# Altium schematic sheet STALO_2.SchDoc: STALO_2 (part 1 of 2)
size D; Date: 09-24-10; DrawnBy: C. Lewis; Engineer: C. Lewis; Address1: 4650 NORRIS CANYON RD.; Address2: SAN RAMON, CA 94583; DocumentNumber: 35133; Revision: D; SheetNumber: 19; SheetTotal: 20; PageSetup: Record=PageOptions|CenterHorizontal=True|CenterVertical=True|PrintScale=0.34|XCorrection=1.00|YCorrection=1.00|PrintKind=1|BorderSize=5000000|LeftOffset=0|BottomOffset=0|Orientation=2|PaperLength=1000|PaperWidth=1000|Scale=100|PaperSource=15|PrintQuality=600|MediaType=1|DitherType=10|PaperKind=11x17|PrintScaleMode=1; DocumentName: Sheet1.SCHDOC; ModifiedDate: 10-27-11
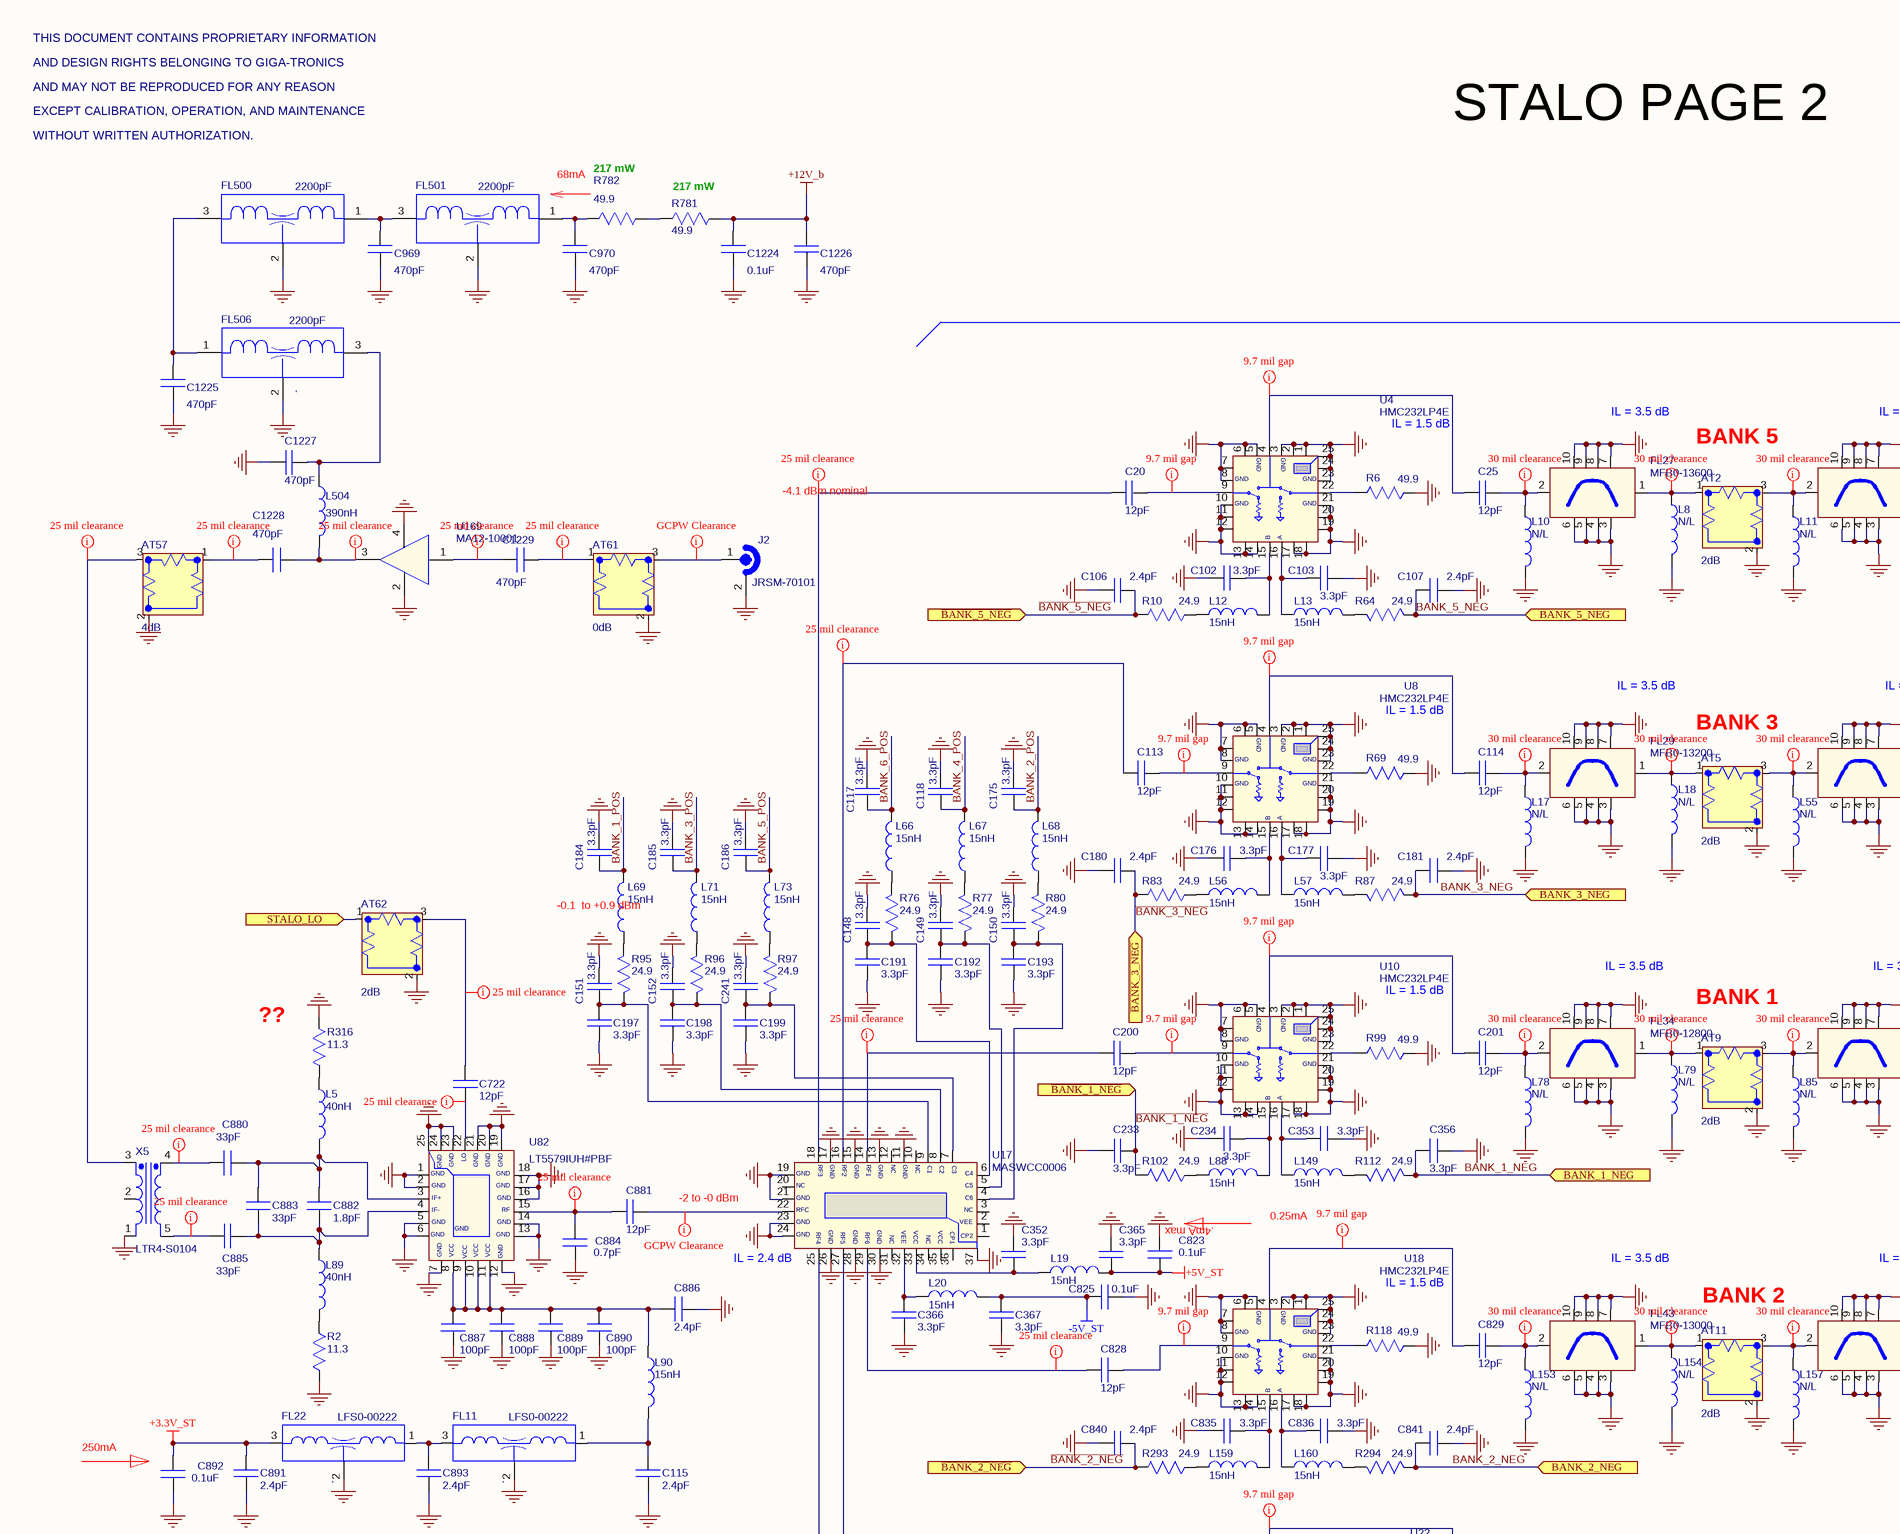
[diagram p0: STALO_2.SchDoc, top left]
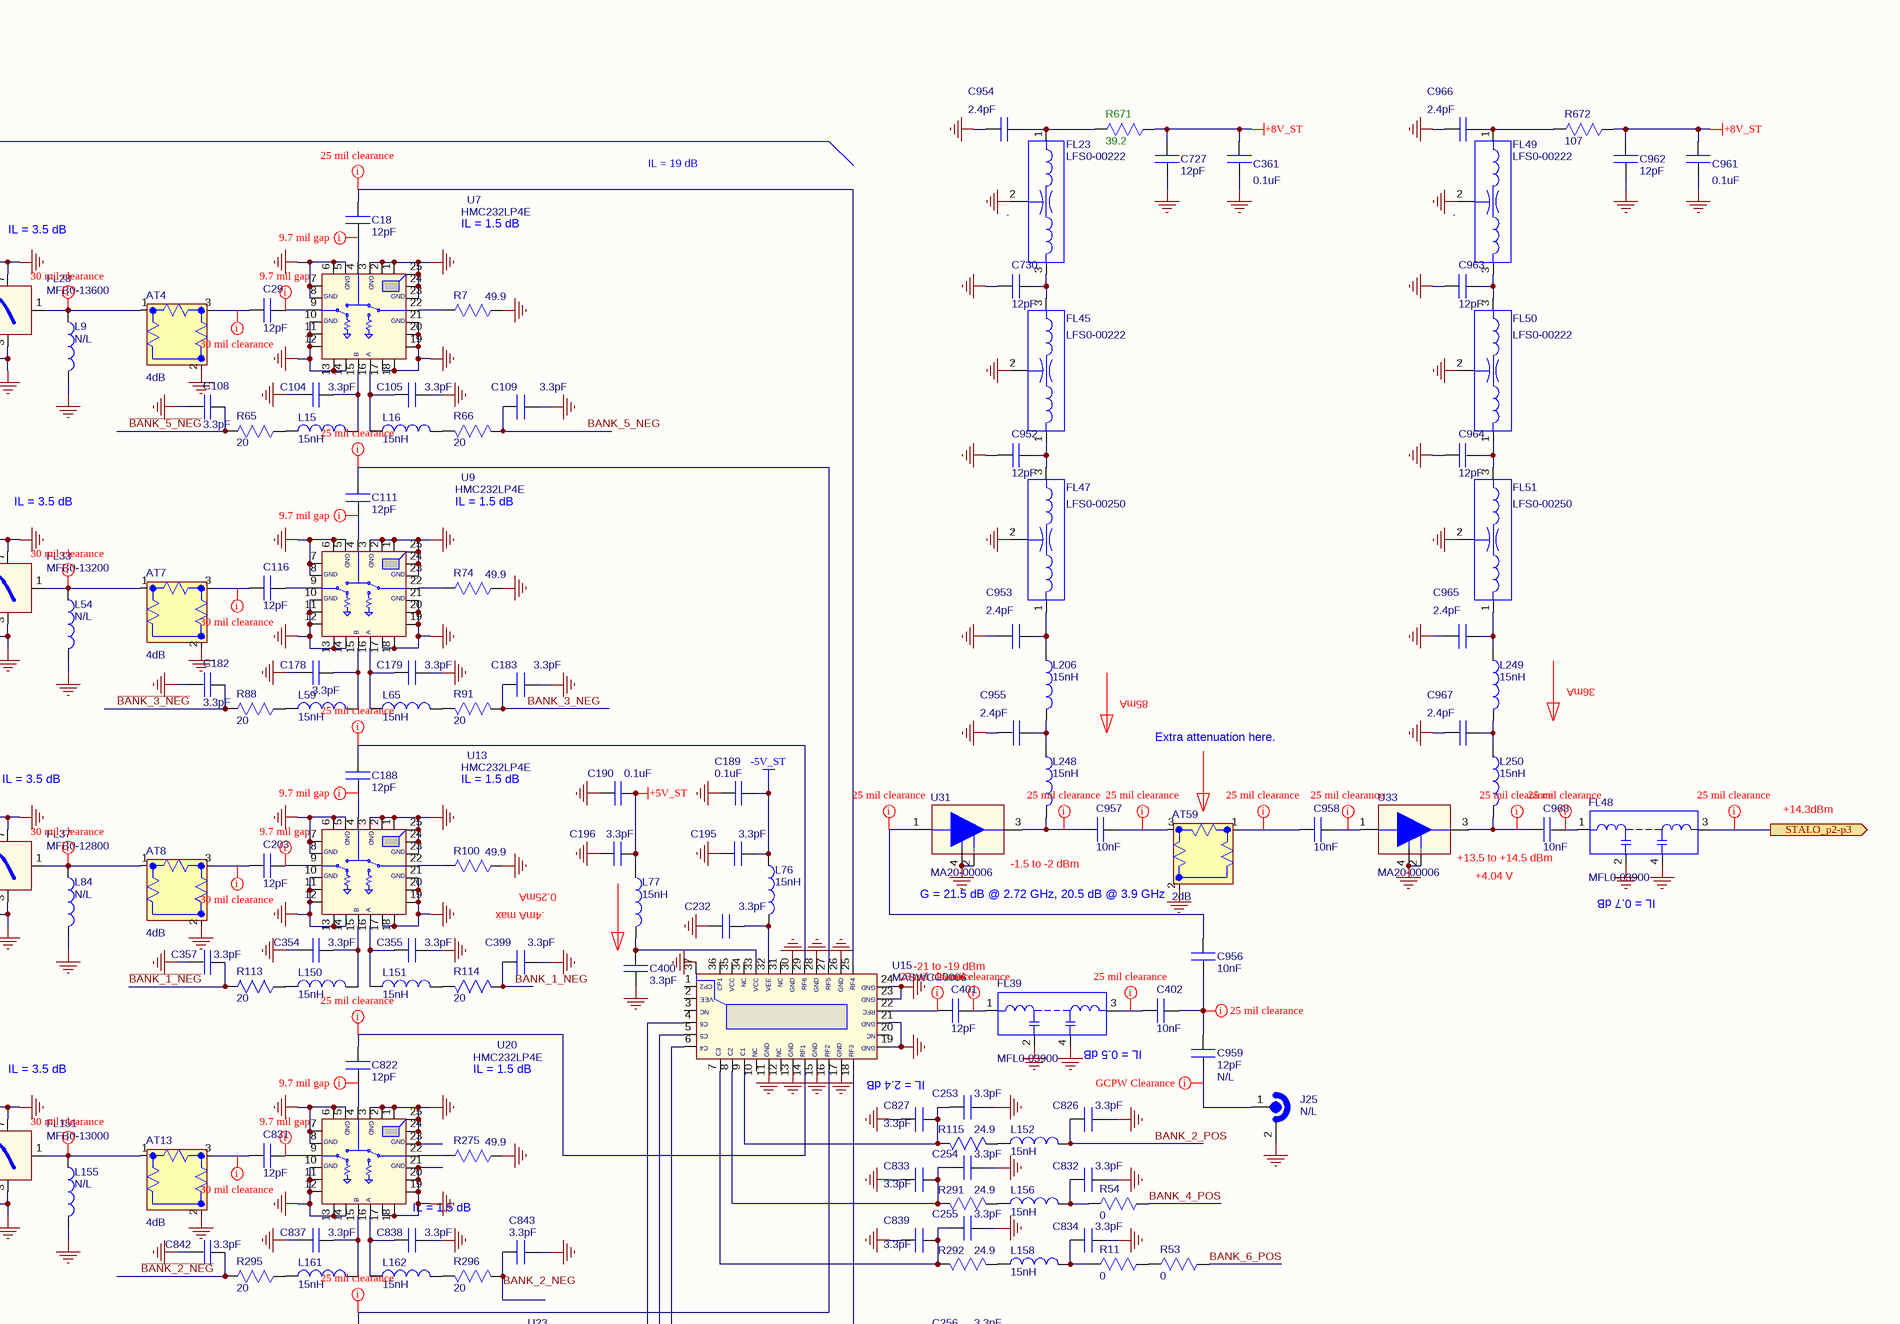
[diagram p1: STALO_2.SchDoc, top right]
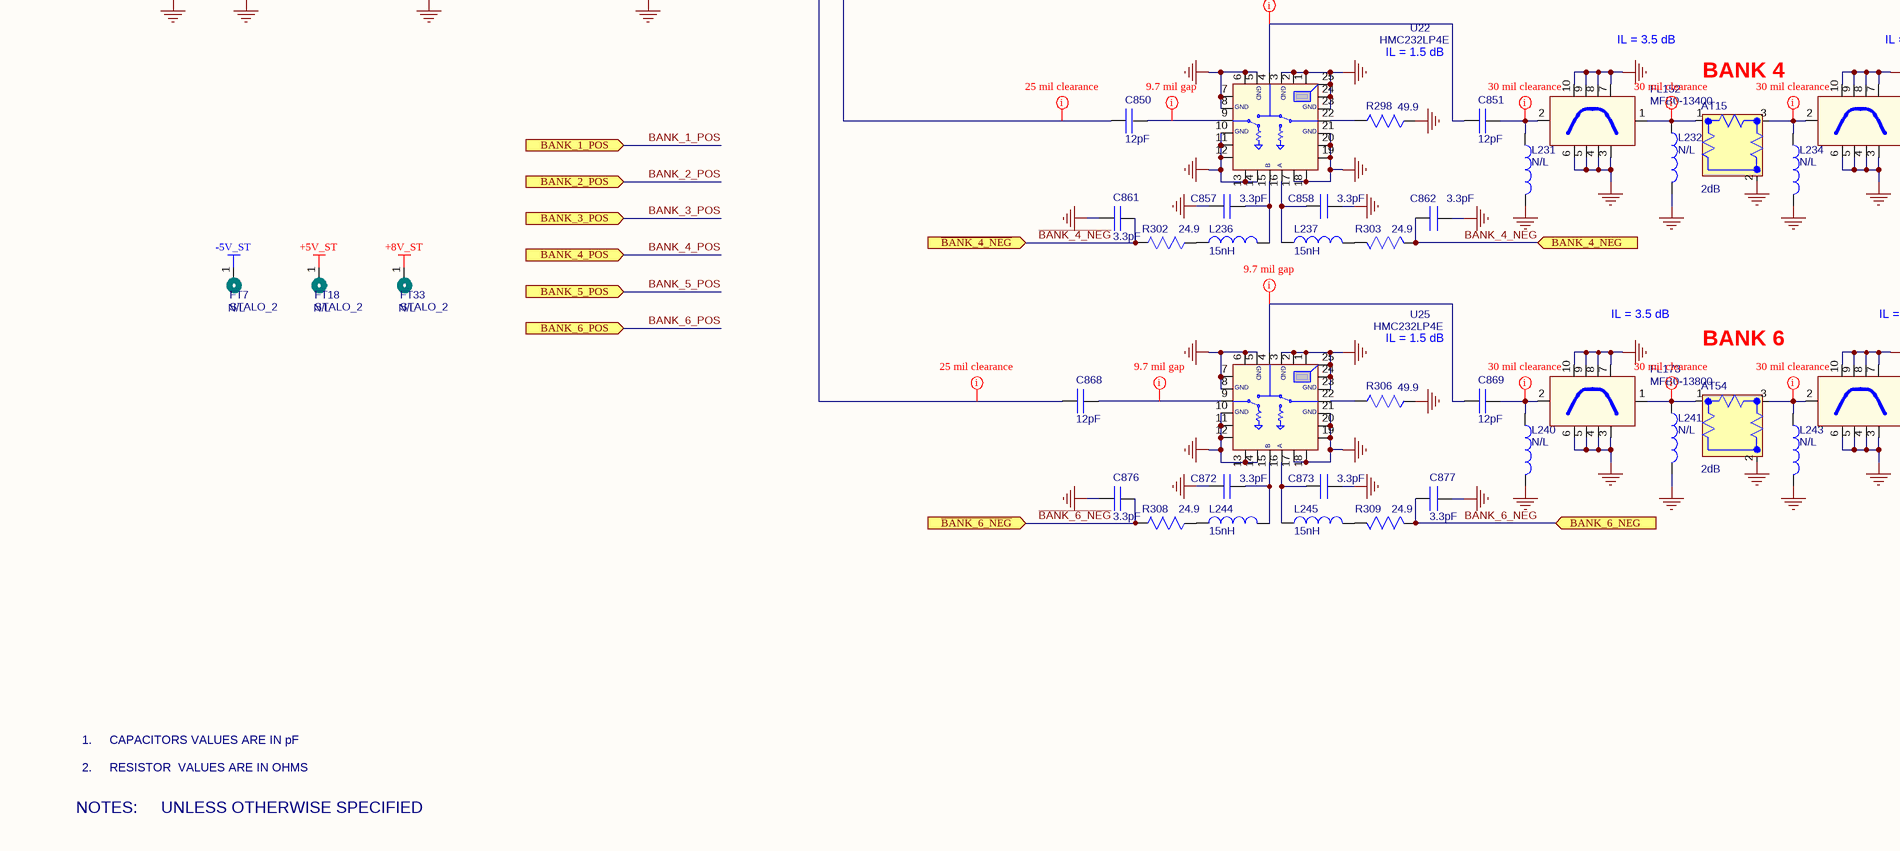
[diagram p2: STALO_2.SchDoc, bottom left]
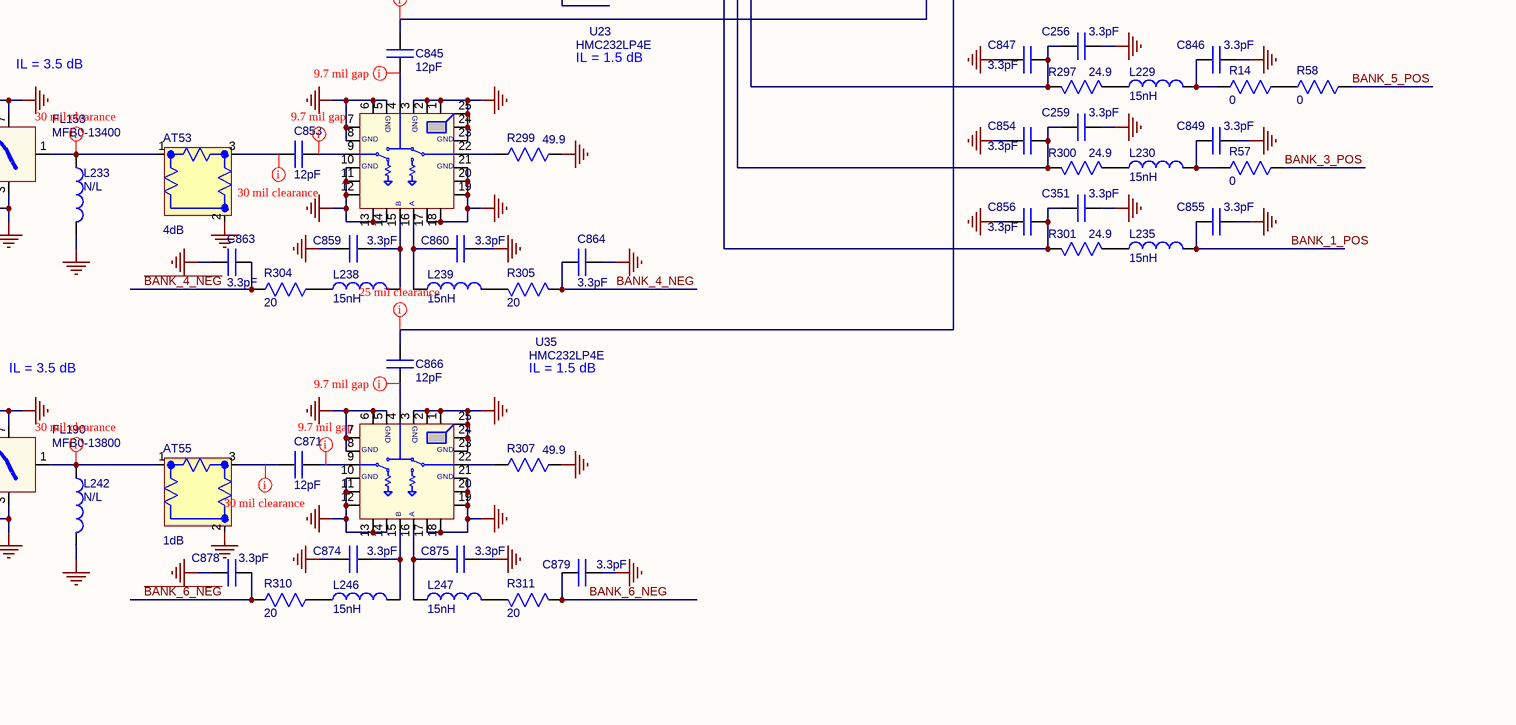
[diagram p3: STALO_2.SchDoc, bottom right]

## Parts
AT2  value 2dB  [ATTN-IMS-0805]  (hidden comment: PAD;CHIP;2dB;+/-.3dB;.08 x .05;50 OHM;FACE DOWN)
AT4  value 4dB  [ATTN-IMS-0805]  (hidden comment: PAD;CHIP;4dB;+/-.3dB;.08 x .05;50 OHM;FACE DOWN)
AT5  value 2dB  [ATTN-IMS-0805]  (hidden comment: PAD;CHIP;2dB;+/-.3dB;.08 x .05;50 OHM;FACE DOWN)
AT7  value 4dB  [ATTN-IMS-0805]  (hidden comment: PAD;CHIP;4dB;+/-.3dB;.08 x .05;50 OHM;FACE DOWN)
AT8  value 4dB  [ATTN-IMS-0805]  (hidden comment: PAD;CHIP;4dB;+/-.3dB;.08 x .05;50 OHM;FACE DOWN)
AT9  value 2dB  [ATTN-IMS-0805]  (hidden comment: PAD;CHIP;2dB;+/-.3dB;.08 x .05;50 OHM;FACE DOWN)
AT11  value 2dB  [ATTN-IMS-0805]  (hidden comment: PAD;CHIP;2dB;+/-.3dB;.08 x .05;50 OHM;FACE DOWN)
AT13  value 4dB  [ATTN-IMS-0805]  (hidden comment: PAD;CHIP;4dB;+/-.3dB;.08 x .05;50 OHM;FACE DOWN)
AT15  value 2dB  [ATTN-IMS-0805]  (hidden comment: PAD;CHIP;2dB;+/-.3dB;.08 x .05;50 OHM;FACE DOWN)
AT53  value 4dB  [ATTN-IMS-0805]  (hidden comment: PAD;CHIP;4dB;+/-.3dB;.08 x .05;50 OHM;FACE DOWN)
AT54  value 2dB  [ATTN-IMS-0805]  (hidden comment: PAD;CHIP;2dB;+/-.3dB;.08 x .05;50 OHM;FACE DOWN)
AT55  value 1dB  [ATTN-IMS-0805]  (hidden comment: PAD;CHIP;1dB;+/-.3dB;.08 x .05;50 OHM;FACE DOWN)
AT57  value 4dB  [ATTN-IMS-0805]  (hidden comment: PAD;CHIP;4dB;+/-.3dB;.08 x .05;50 OHM;FACE DOWN)
AT59  value 2dB  [ATTN-IMS-0805]  (hidden comment: PAD;CHIP;2dB;+/-.3dB;.08 x .05;50 OHM;FACE DOWN)
AT61  value 0dB  [ATTN-IMS-0805]  (hidden comment: PAD;CHIP;0dB;+/-.3dB;.08 x .05;50 OHM;FACE DOWN)
AT62  value 2dB  [ATTN-IMS-0805]  (hidden comment: PAD;CHIP;2dB;+/-.3dB;.08 x .05;50 OHM;FACE DOWN)
C18  value 12pF  [CAP-0402-N]  (hidden comment: 12 PF;5%;COG;>50V;CHIP;0402)
C20  value 12pF  [CAP-0402-N]  (hidden comment: 12 PF;5%;COG;>50V;CHIP;0402)
C25  value 12pF  [CAP-0402-N]  (hidden comment: 12 PF;5%;COG;>50V;CHIP;0402)
C29  value 12pF  [CAP-0402-N]  (hidden comment: 12 PF;5%;COG;>50V;CHIP;0402)
C102  value 3.3pF  [CAP-0201-N]  (hidden comment: 3.3pF;5%;COG;50V;CHIP;0201)
C103  value 3.3pF  [CAP-0201-N]  (hidden comment: 3.3pF;5%;COG;50V;CHIP;0201)
C104  value 3.3pF  [CAP-0201-N]  (hidden comment: 3.3pF;5%;COG;50V;CHIP;0201)
C105  value 3.3pF  [CAP-0201-N]  (hidden comment: 3.3pF;5%;COG;50V;CHIP;0201)
C106  value 2.4pF  [CAP-0402-RF]  (hidden comment: 2.4 PF;200V;.05PF;HIGH Q;SMT;CERAMIC;0402)
C107  value 2.4pF  [CAP-0402-RF]  (hidden comment: 2.4 PF;200V;.05PF;HIGH Q;SMT;CERAMIC;0402)
C108  value 3.3pF  [CAP-0201-N]  (hidden comment: 3.3pF;5%;COG;50V;CHIP;0201)
C109  value 3.3pF  [CAP-0201-N]  (hidden comment: 3.3pF;5%;COG;50V;CHIP;0201)
C111  value 12pF  [CAP-0402-N]  (hidden comment: 12 PF;5%;COG;>50V;CHIP;0402)
C113  value 12pF  [CAP-0402-N]  (hidden comment: 12 PF;5%;COG;>50V;CHIP;0402)
C114  value 12pF  [CAP-0402-N]  (hidden comment: 12 PF;5%;COG;>50V;CHIP;0402)
C115  value 2.4pF  [CAP-0402-RF]  (hidden comment: 2.4 PF;200V;.05PF;HIGH Q;SMT;CERAMIC;0402)
C116  value 12pF  [CAP-0402-N]  (hidden comment: 12 PF;5%;COG;>50V;CHIP;0402)
C117  value 3.3pF  [CAP-0201-N]  (hidden comment: 3.3pF;5%;COG;50V;CHIP;0201)
C118  value 3.3pF  [CAP-0201-N]  (hidden comment: 3.3pF;5%;COG;50V;CHIP;0201)
C148  value 3.3pF  [CAP-0201-N]  (hidden comment: 3.3pF;5%;COG;50V;CHIP;0201)
C149  value 3.3pF  [CAP-0201-N]  (hidden comment: 3.3pF;5%;COG;50V;CHIP;0201)
C150  value 3.3pF  [CAP-0201-N]  (hidden comment: 3.3pF;5%;COG;50V;CHIP;0201)
C151  value 3.3pF  [CAP-0201-N]  (hidden comment: 3.3pF;5%;COG;50V;CHIP;0201)
C152  value 3.3pF  [CAP-0201-N]  (hidden comment: 3.3pF;5%;COG;50V;CHIP;0201)
C175  value 3.3pF  [CAP-0201-N]  (hidden comment: 3.3pF;5%;COG;50V;CHIP;0201)
C176  value 3.3pF  [CAP-0201-N]  (hidden comment: 3.3pF;5%;COG;50V;CHIP;0201)
C177  value 3.3pF  [CAP-0201-N]  (hidden comment: 3.3pF;5%;COG;50V;CHIP;0201)
C178  value 3.3pF  [CAP-0201-N]  (hidden comment: 3.3pF;5%;COG;50V;CHIP;0201)
C179  value 3.3pF  [CAP-0201-N]  (hidden comment: 3.3pF;5%;COG;50V;CHIP;0201)
C180  value 2.4pF  [CAP-0402-RF]  (hidden comment: 2.4 PF;200V;.05PF;HIGH Q;SMT;CERAMIC;0402)
C181  value 2.4pF  [CAP-0402-RF]  (hidden comment: 2.4 PF;200V;.05PF;HIGH Q;SMT;CERAMIC;0402)
C182  value 3.3pF  [CAP-0201-N]  (hidden comment: 3.3pF;5%;COG;50V;CHIP;0201)
C183  value 3.3pF  [CAP-0201-N]  (hidden comment: 3.3pF;5%;COG;50V;CHIP;0201)
C184  value 3.3pF  [CAP-0201-N]  (hidden comment: 3.3pF;5%;COG;50V;CHIP;0201)
C185  value 3.3pF  [CAP-0201-N]  (hidden comment: 3.3pF;5%;COG;50V;CHIP;0201)
C186  value 3.3pF  [CAP-0201-N]  (hidden comment: 3.3pF;5%;COG;50V;CHIP;0201)
C188  value 12pF  [CAP-0402-N]  (hidden comment: 12 PF;5%;COG;>50V;CHIP;0402)
C189  value 0.1uF  [CAP-0402-N]  (hidden comment: .1 UF,10%;X7R;16V,CHIP;0402)
C190  value 0.1uF  [CAP-0402-N]  (hidden comment: .1 UF,10%;X7R;16V,CHIP;0402)
C191  value 3.3pF  [CAP-0201-N]  (hidden comment: 3.3pF;5%;COG;50V;CHIP;0201)
C192  value 3.3pF  [CAP-0201-N]  (hidden comment: 3.3pF;5%;COG;50V;CHIP;0201)
C193  value 3.3pF  [CAP-0201-N]  (hidden comment: 3.3pF;5%;COG;50V;CHIP;0201)
C195  value 3.3pF  [CAP-0201-N]  (hidden comment: 3.3pF;5%;COG;50V;CHIP;0201)
C196  value 3.3pF  [CAP-0201-N]  (hidden comment: 3.3pF;5%;COG;50V;CHIP;0201)
C197  value 3.3pF  [CAP-0201-N]  (hidden comment: 3.3pF;5%;COG;50V;CHIP;0201)
C198  value 3.3pF  [CAP-0201-N]  (hidden comment: 3.3pF;5%;COG;50V;CHIP;0201)
C199  value 3.3pF  [CAP-0201-N]  (hidden comment: 3.3pF;5%;COG;50V;CHIP;0201)
C200  value 12pF  [CAP-0402-N]  (hidden comment: 12 PF;5%;COG;>50V;CHIP;0402)
C201  value 12pF  [CAP-0402-N]  (hidden comment: 12 PF;5%;COG;>50V;CHIP;0402)
C203  value 12pF  [CAP-0402-N]  (hidden comment: 12 PF;5%;COG;>50V;CHIP;0402)
C232  value 3.3pF  [CAP-0201-N]  (hidden comment: 3.3pF;5%;COG;50V;CHIP;0201)
C233  value 3.3pF  [CAP-0201-N]  (hidden comment: 3.3pF;5%;COG;50V;CHIP;0201)
C234  value 3.3pF  [CAP-0201-N]  (hidden comment: 3.3pF;5%;COG;50V;CHIP;0201)
C241  value 3.3pF  [CAP-0201-N]  (hidden comment: 3.3pF;5%;COG;50V;CHIP;0201)
C253  value 3.3pF  [CAP-0201-N]  (hidden comment: 3.3pF;5%;COG;50V;CHIP;0201)
C254  value 3.3pF  [CAP-0201-N]  (hidden comment: 3.3pF;5%;COG;50V;CHIP;0201)
C255  value 3.3pF  [CAP-0201-N]  (hidden comment: 3.3pF;5%;COG;50V;CHIP;0201)
C256  value 3.3pF  [CAP-0201-N]  (hidden comment: 3.3pF;5%;COG;50V;CHIP;0201)
C259  value 3.3pF  [CAP-0201-N]  (hidden comment: 3.3pF;5%;COG;50V;CHIP;0201)
C351  value 3.3pF  [CAP-0201-N]  (hidden comment: 3.3pF;5%;COG;50V;CHIP;0201)
C352  value 3.3pF  [CAP-0201-N]  (hidden comment: 3.3pF;5%;COG;50V;CHIP;0201)
C353  value 3.3pF  [CAP-0201-N]  (hidden comment: 3.3pF;5%;COG;50V;CHIP;0201)
C354  value 3.3pF  [CAP-0201-N]  (hidden comment: 3.3pF;5%;COG;50V;CHIP;0201)
C355  value 3.3pF  [CAP-0201-N]  (hidden comment: 3.3pF;5%;COG;50V;CHIP;0201)
C356  value 3.3pF  [CAP-0201-N]  (hidden comment: 3.3pF;5%;COG;50V;CHIP;0201)
C357  value 3.3pF  [CAP-0201-N]  (hidden comment: 3.3pF;5%;COG;50V;CHIP;0201)
C361  value 0.1uF  [CAP-0603-H035-N]  (hidden comment: .1UF;10%;X7R;16V;CHIP;0603)
C365  value 3.3pF  [CAP-0201-N]  (hidden comment: 3.3pF;5%;COG;50V;CHIP;0201)
C366  value 3.3pF  [CAP-0201-N]  (hidden comment: 3.3pF;5%;COG;50V;CHIP;0201)
C367  value 3.3pF  [CAP-0201-N]  (hidden comment: 3.3pF;5%;COG;50V;CHIP;0201)
C399  value 3.3pF  [CAP-0201-N]  (hidden comment: 3.3pF;5%;COG;50V;CHIP;0201)
C400  value 3.3pF  [CAP-0201-N]  (hidden comment: 3.3pF;5%;COG;50V;CHIP;0201)
C401  value 12pF  [CAP-0402-N]  (hidden comment: 12 PF;5%;COG;>50V;CHIP;0402)
C402  value 10nF  [CAP-0402-N]  (hidden comment: 10nF;10%;X7R;16 WVDC;CHIP;0402)
C722  value 12pF  [CAP-0402-N]  (hidden comment: 12 PF;5%;COG;>50V;CHIP;0402)
C727  value 12pF  [CAP-0402-N]  (hidden comment: 12 PF;5%;COG;>50V;CHIP;0402)
C730  value 12pF  [CAP-0402-N]  (hidden comment: 12 PF;5%;COG;>50V;CHIP;0402)
C822  value 12pF  [CAP-0402-N]  (hidden comment: 12 PF;5%;COG;>50V;CHIP;0402)
C823  value 0.1uF  [CAP-0402-N]  (hidden comment: .1 UF,10%;X7R;16V,CHIP;0402)
C825  value 0.1uF  [CAP-0402-N]  (hidden comment: .1 UF,10%;X7R;16V,CHIP;0402)
C826  value 3.3pF  [CAP-0201-N]  (hidden comment: 3.3pF;5%;COG;50V;CHIP;0201)
C827  value 3.3pF  [CAP-0201-N]  (hidden comment: 3.3pF;5%;COG;50V;CHIP;0201)
C828  value 12pF  [CAP-0402-N]  (hidden comment: 12 PF;5%;COG;>50V;CHIP;0402)
C829  value 12pF  [CAP-0402-N]  (hidden comment: 12 PF;5%;COG;>50V;CHIP;0402)
C831  value 12pF  [CAP-0402-N]  (hidden comment: 12 PF;5%;COG;>50V;CHIP;0402)
C832  value 3.3pF  [CAP-0201-N]  (hidden comment: 3.3pF;5%;COG;50V;CHIP;0201)
C833  value 3.3pF  [CAP-0201-N]  (hidden comment: 3.3pF;5%;COG;50V;CHIP;0201)
C834  value 3.3pF  [CAP-0201-N]  (hidden comment: 3.3pF;5%;COG;50V;CHIP;0201)
C835  value 3.3pF  [CAP-0201-N]  (hidden comment: 3.3pF;5%;COG;50V;CHIP;0201)
C836  value 3.3pF  [CAP-0201-N]  (hidden comment: 3.3pF;5%;COG;50V;CHIP;0201)
C837  value 3.3pF  [CAP-0201-N]  (hidden comment: 3.3pF;5%;COG;50V;CHIP;0201)
C838  value 3.3pF  [CAP-0201-N]  (hidden comment: 3.3pF;5%;COG;50V;CHIP;0201)
C839  value 3.3pF  [CAP-0201-N]  (hidden comment: 3.3pF;5%;COG;50V;CHIP;0201)
C840  value 2.4pF  [CAP-0402-RF]  (hidden comment: 2.4 PF;200V;.05PF;HIGH Q;SMT;CERAMIC;0402)
C841  value 2.4pF  [CAP-0402-RF]  (hidden comment: 2.4 PF;200V;.05PF;HIGH Q;SMT;CERAMIC;0402)
C842  value 3.3pF  [CAP-0201-N]  (hidden comment: 3.3pF;5%;COG;50V;CHIP;0201)
C843  value 3.3pF  [CAP-0201-N]  (hidden comment: 3.3pF;5%;COG;50V;CHIP;0201)
C845  value 12pF  [CAP-0402-N]  (hidden comment: 12 PF;5%;COG;>50V;CHIP;0402)
C846  value 3.3pF  [CAP-0201-N]  (hidden comment: 3.3pF;5%;COG;50V;CHIP;0201)
C847  value 3.3pF  [CAP-0201-N]  (hidden comment: 3.3pF;5%;COG;50V;CHIP;0201)
C849  value 3.3pF  [CAP-0201-N]  (hidden comment: 3.3pF;5%;COG;50V;CHIP;0201)
C850  value 12pF  [CAP-0402-N]  (hidden comment: 12 PF;5%;COG;>50V;CHIP;0402)
C851  value 12pF  [CAP-0402-N]  (hidden comment: 12 PF;5%;COG;>50V;CHIP;0402)
C853  value 12pF  [CAP-0402-N]  (hidden comment: 12 PF;5%;COG;>50V;CHIP;0402)
C854  value 3.3pF  [CAP-0201-N]  (hidden comment: 3.3pF;5%;COG;50V;CHIP;0201)
C855  value 3.3pF  [CAP-0201-N]  (hidden comment: 3.3pF;5%;COG;50V;CHIP;0201)
C856  value 3.3pF  [CAP-0201-N]  (hidden comment: 3.3pF;5%;COG;50V;CHIP;0201)
C857  value 3.3pF  [CAP-0201-N]  (hidden comment: 3.3pF;5%;COG;50V;CHIP;0201)
C858  value 3.3pF  [CAP-0201-N]  (hidden comment: 3.3pF;5%;COG;50V;CHIP;0201)
C859  value 3.3pF  [CAP-0201-N]  (hidden comment: 3.3pF;5%;COG;50V;CHIP;0201)
C860  value 3.3pF  [CAP-0201-N]  (hidden comment: 3.3pF;5%;COG;50V;CHIP;0201)
C861  value 3.3pF  [CAP-0201-N]  (hidden comment: 3.3pF;5%;COG;50V;CHIP;0201)
C862  value 3.3pF  [CAP-0201-N]  (hidden comment: 3.3pF;5%;COG;50V;CHIP;0201)
C863  value 3.3pF  [CAP-0201-N]  (hidden comment: 3.3pF;5%;COG;50V;CHIP;0201)
C864  value 3.3pF  [CAP-0201-N]  (hidden comment: 3.3pF;5%;COG;50V;CHIP;0201)
C866  value 12pF  [CAP-0402-N]  (hidden comment: 12 PF;5%;COG;>50V;CHIP;0402)
C868  value 12pF  [CAP-0402-N]  (hidden comment: 12 PF;5%;COG;>50V;CHIP;0402)
C869  value 12pF  [CAP-0402-N]  (hidden comment: 12 PF;5%;COG;>50V;CHIP;0402)
C871  value 12pF  [CAP-0402-N]  (hidden comment: 12 PF;5%;COG;>50V;CHIP;0402)
C872  value 3.3pF  [CAP-0201-N]  (hidden comment: 3.3pF;5%;COG;50V;CHIP;0201)
C873  value 3.3pF  [CAP-0201-N]  (hidden comment: 3.3pF;5%;COG;50V;CHIP;0201)
C874  value 3.3pF  [CAP-0201-N]  (hidden comment: 3.3pF;5%;COG;50V;CHIP;0201)
C875  value 3.3pF  [CAP-0201-N]  (hidden comment: 3.3pF;5%;COG;50V;CHIP;0201)
C876  value 3.3pF  [CAP-0201-N]  (hidden comment: 3.3pF;5%;COG;50V;CHIP;0201)
C877  value 3.3pF  [CAP-0201-N]  (hidden comment: 3.3pF;5%;COG;50V;CHIP;0201)
C878  value 3.3pF  [CAP-0201-N]  (hidden comment: 3.3pF;5%;COG;50V;CHIP;0201)
C879  value 3.3pF  [CAP-0201-N]  (hidden comment: 3.3pF;5%;COG;50V;CHIP;0201)
C880  value 33pF  [CAP-0402-N]  (hidden comment: 33 PF;5%;COG;>50V;CHIP;0402)
C881  value 12pF  [CAP-0402-N]  (hidden comment: 12 PF;5%;COG;>50V;CHIP;0402)
C882  value 1.8pF  [CAP-0402-RF]  (hidden comment: 1.8 PF;200V;.05PF;HIGH Q;SMT;CERAMIC;0402)
C883  value 33pF  [CAP-0402-N]  (hidden comment: 33 PF;5%;COG;>50V;CHIP;0402)
C884  value 0.7pF  [CAP-0402-RF]  (hidden comment: .7 PF;200V;.05PF;HIGH Q;SMT;CERAMIC;0402)
C885  value 33pF  [CAP-0402-N]  (hidden comment: 33 PF;5%;COG;>50V;CHIP;0402)
C886  value 2.4pF  [CAP-0402-RF]  (hidden comment: 2.4 PF;200V;.05PF;HIGH Q;SMT;CERAMIC;0402)
C887  value 100pF  [CAP-0402-N]  (hidden comment: 100 PF;5%;COG;>50V;CHIP;0402)
C888  value 100pF  [CAP-0402-N]  (hidden comment: 100 PF;5%;COG;>50V;CHIP;0402)
C889  value 100pF  [CAP-0402-N]  (hidden comment: 100 PF;5%;COG;>50V;CHIP;0402)
C890  value 100pF  [CAP-0402-N]  (hidden comment: 100 PF;5%;COG;>50V;CHIP;0402)
C891  value 2.4pF  [CAP-0402-RF]  (hidden comment: 2.4 PF;200V;.05PF;HIGH Q;SMT;CERAMIC;0402)
C892  value 0.1uF  [CAP-0402-N]  (hidden comment: .1 UF,10%;X7R;16V,CHIP;0402)
C893  value 2.4pF  [CAP-0402-RF]  (hidden comment: 2.4 PF;200V;.05PF;HIGH Q;SMT;CERAMIC;0402)
C952  value 12pF  [CAP-0402-N]  (hidden comment: 12 PF;5%;COG;>50V;CHIP;0402)
C953  value 2.4pF  [CAP-0402-RF]  (hidden comment: 2.4 PF;200V;.05PF;HIGH Q;SMT;CERAMIC;0402)
C954  value 2.4pF  [CAP-0402-RF]  (hidden comment: 2.4 PF;200V;.05PF;HIGH Q;SMT;CERAMIC;0402)
C955  value 2.4pF  [CAP-0402-RF]  (hidden comment: 2.4 PF;200V;.05PF;HIGH Q;SMT;CERAMIC;0402)
C956  value 10nF  [CAP-0402-N]  (hidden comment: 10nF;10%;X7R;16 WVDC;CHIP;0402)
C957  value 10nF  [CAP-0402-N]  (hidden comment: 10nF;10%;X7R;16 WVDC;CHIP;0402)
C958  value 10nF  [CAP-0402-N]  (hidden comment: 10nF;10%;X7R;16 WVDC;CHIP;0402)
C959  value 12pF  NoLoad: N/L  [CAP-0402-N]  (hidden comment: 12 PF;5%;COG;>50V;CHIP;0402)
C961  value 0.1uF  [CAP-0603-H035-N]  (hidden comment: .1UF;10%;X7R;16V;CHIP;0603)
C962  value 12pF  [CAP-0402-N]  (hidden comment: 12 PF;5%;COG;>50V;CHIP;0402)
C963  value 12pF  [CAP-0402-N]  (hidden comment: 12 PF;5%;COG;>50V;CHIP;0402)
C964  value 12pF  [CAP-0402-N]  (hidden comment: 12 PF;5%;COG;>50V;CHIP;0402)
C965  value 2.4pF  [CAP-0402-RF]  (hidden comment: 2.4 PF;200V;.05PF;HIGH Q;SMT;CERAMIC;0402)
C966  value 2.4pF  [CAP-0402-RF]  (hidden comment: 2.4 PF;200V;.05PF;HIGH Q;SMT;CERAMIC;0402)
C967  value 2.4pF  [CAP-0402-RF]  (hidden comment: 2.4 PF;200V;.05PF;HIGH Q;SMT;CERAMIC;0402)
C968  value 10nF  [CAP-0402-N]  (hidden comment: 10nF;10%;X7R;16 WVDC;CHIP;0402)
C969  value 470pF  [CAP-0402-N]  (hidden comment: 470 PF;5%;COG;>50V;CHIP;0402)
C970  value 470pF  [CAP-0402-N]  (hidden comment: 470 PF;5%;COG;>50V;CHIP;0402)
C1224  value 0.1uF  [CAP-0603-H035-N]  (hidden comment: .1UF;10%;X7R;16V;CHIP;0603)
C1225  value 470pF  [CAP-0402-N]  (hidden comment: 470 PF;5%;COG;>50V;CHIP;0402)
C1226  value 470pF  [CAP-0402-N]  (hidden comment: 470 PF;5%;COG;>50V;CHIP;0402)
C1227  value 470pF  [CAP-0402-N]  (hidden comment: 470 PF;5%;COG;>50V;CHIP;0402)
C1228  value 470pF  [CAP-0402-N]  (hidden comment: 470 PF;5%;COG;>50V;CHIP;0402)
C1229  value 470pF  [CAP-0402-N]  (hidden comment: 470 PF;5%;COG;>50V;CHIP;0402)
FL11  Filter EMI 2200PF,1206  [FIL-NFE31P-1206-4P]  (value not drawn)
FL22  Filter EMI 2200PF,1206  [FIL-NFE31P-1206-4P]  (value not drawn)
FL23  Filter EMI 2200PF,1206  [FIL-NFE31P-1206-4P]  (value not drawn)
FL27  FILTER;CER;BANDPASS;3600MHZ;200MHZ BW;6-SEC;SMT  [S11H_IMC]  (value not drawn)
FL28  FILTER;CER;BANDPASS;3600MHZ;200MHZ BW;6-SEC;SMT  [S11H_IMC]  (value not drawn)
FL29  FILTER;CER;BANDPASS;3200MHZ;200MHZ BW;6-SEC;SMT  [S11H_IMC]  (value not drawn)
FL33  FILTER;CER;BANDPASS;3200MHZ;200MHZ BW;6-SEC;SMT  [S11H_IMC]  (value not drawn)
FL34  FILTER;CER;BANDPASS;2800MHZ;200MHZ BW;6-SEC;SMT  [S11H_IMC]  (value not drawn)
FL37  FILTER;CER;BANDPASS;2800MHZ;200MHZ BW;6-SEC;SMT  [S11H_IMC]  (value not drawn)
FL39  FILTER;LOW PASS;3900MHz;7SEC;FV1206  [FV1206]  (value not drawn)
FL43  FILTER;CER;BANDPASS;2800MHZ;200MHZ BW;6-SEC;SMT  [S11H_IMC]  (value not drawn)
FL45  Filter EMI 2200PF,1206  [FIL-NFE31P-1206-4P]  (value not drawn)
FL47  F/T FILTER;CHIP;2.5 DCR150MA;16V;T LC;25PF;200MHz;0603  [FIL-NFL18ST]  (value not drawn)
FL48  FILTER;LOW PASS;3900MHz;7SEC;FV1206  [FV1206]  (value not drawn)
FL49  Filter EMI 2200PF,1206  [FIL-NFE31P-1206-4P]  (value not drawn)
FL50  Filter EMI 2200PF,1206  [FIL-NFE31P-1206-4P]  (value not drawn)
FL51  F/T FILTER;CHIP;2.5 DCR150MA;16V;T LC;25PF;200MHz;0603  [FIL-NFL18ST]  (value not drawn)
FL151  FILTER;CER;BANDPASS;2800MHZ;200MHZ BW;6-SEC;SMT  [S11H_IMC]  (value not drawn)
FL152  FILTER;CER;BANDPASS;3400MHZ;200MHZ BW;6-SEC;SMT  [S11H_IMC]  (value not drawn)
FL153  FILTER;CER;BANDPASS;3400MHZ;200MHZ BW;6-SEC;SMT  [S11H_IMC]  (value not drawn)
FL173  FILTER;CER;BANDPASS;3800MHZ;200MHZ BW;6-SEC;SMT  [S11H_IMC]  (value not drawn)
FL190  FILTER;CER;BANDPASS;3800MHZ;200MHZ BW;6-SEC;SMT  [S11H_IMC]  (value not drawn)
FL500  2200pF  [FIL-NFE31P-1206-4P]
FL501  2200pF  [FIL-NFE31P-1206-4P]
FL506  2200pF  [FIL-NFE31P-1206-4P]
FT7  STALO_2  NoLoad: N/L  [FromToNode_ML2]  (net tie, no BOM)
FT18  STALO_2  NoLoad: N/L  [FromToNode_ML2]  (net tie, no BOM)
FT33  STALO_2  NoLoad: N/L  [FromToNode_ML2]  (net tie, no BOM)
J2  .  [JRSM-70101]  (value not drawn)
J25  NoLoad: N/L  [JRSM-40101]  (hidden comment: SMPM;SB;MALE;STRAIGHT;SMT;.152X.152X.150;PCB;R/A CONTACT)
L5  value 40nH  [IND-0402CS]  (hidden comment: INDUCTOR,40 NH SM 0402 PKG)
L8  NoLoad: N/L  [IND-0402HP]  (hidden comment: INDUCTOR;3.9NH;2%;9.5GHZ SRF;98Q @1.7GHZ;.045 DCR;1.7A;0402)
L9  NoLoad: N/L  [IND-0402HP]  (hidden comment: INDUCTOR;3.9NH;2%;9.5GHZ SRF;98Q @1.7GHZ;.045 DCR;1.7A;0402)
L10  NoLoad: N/L  [IND-0402HP]  (hidden comment: INDUCTOR;3.9NH;2%;9.5GHZ SRF;98Q @1.7GHZ;.045 DCR;1.7A;0402)
L11  NoLoad: N/L  [IND-0402HP]  (hidden comment: INDUCTOR;3.9NH;2%;9.5GHZ SRF;98Q @1.7GHZ;.045 DCR;1.7A;0402)
L12  value 15nH  [IND-0402HP]  (hidden comment: INDUCTOR;15NH;2%;3.9GHZ SRF;85Q @1.7GHZ;.078 DCR;1.1A;0402)
L13  value 15nH  [IND-0402HP]  (hidden comment: INDUCTOR;15NH;2%;3.9GHZ SRF;85Q @1.7GHZ;.078 DCR;1.1A;0402)
L15  value 15nH  [IND-0402HP]  (hidden comment: INDUCTOR;15NH;2%;3.9GHZ SRF;85Q @1.7GHZ;.078 DCR;1.1A;0402)
L16  value 15nH  [IND-0402HP]  (hidden comment: INDUCTOR;15NH;2%;3.9GHZ SRF;85Q @1.7GHZ;.078 DCR;1.1A;0402)
L17  NoLoad: N/L  [IND-0402HP]  (hidden comment: INDUCTOR;3.9NH;2%;9.5GHZ SRF;98Q @1.7GHZ;.045 DCR;1.7A;0402)
L18  NoLoad: N/L  [IND-0402HP]  (hidden comment: INDUCTOR;3.9NH;2%;9.5GHZ SRF;98Q @1.7GHZ;.045 DCR;1.7A;0402)
L19  value 15nH  [IND-0402HP]  (hidden comment: INDUCTOR;15NH;2%;3.9GHZ SRF;85Q @1.7GHZ;.078 DCR;1.1A;0402)
L20  value 15nH  [IND-0402HP]  (hidden comment: INDUCTOR;15NH;2%;3.9GHZ SRF;85Q @1.7GHZ;.078 DCR;1.1A;0402)
L54  NoLoad: N/L  [IND-0402HP]  (hidden comment: INDUCTOR;3.9NH;2%;9.5GHZ SRF;98Q @1.7GHZ;.045 DCR;1.7A;0402)
L55  NoLoad: N/L  [IND-0402HP]  (hidden comment: INDUCTOR;3.9NH;2%;9.5GHZ SRF;98Q @1.7GHZ;.045 DCR;1.7A;0402)
L56  value 15nH  [IND-0402HP]  (hidden comment: INDUCTOR;15NH;2%;3.9GHZ SRF;85Q @1.7GHZ;.078 DCR;1.1A;0402)
L57  value 15nH  [IND-0402HP]  (hidden comment: INDUCTOR;15NH;2%;3.9GHZ SRF;85Q @1.7GHZ;.078 DCR;1.1A;0402)
L59  value 15nH  [IND-0402HP]  (hidden comment: INDUCTOR;15NH;2%;3.9GHZ SRF;85Q @1.7GHZ;.078 DCR;1.1A;0402)
L65  value 15nH  [IND-0402HP]  (hidden comment: INDUCTOR;15NH;2%;3.9GHZ SRF;85Q @1.7GHZ;.078 DCR;1.1A;0402)
L66  value 15nH  [IND-0402HP]  (hidden comment: INDUCTOR;15NH;2%;3.9GHZ SRF;85Q @1.7GHZ;.078 DCR;1.1A;0402)
L67  value 15nH  [IND-0402HP]  (hidden comment: INDUCTOR;15NH;2%;3.9GHZ SRF;85Q @1.7GHZ;.078 DCR;1.1A;0402)
L68  value 15nH  [IND-0402HP]  (hidden comment: INDUCTOR;15NH;2%;3.9GHZ SRF;85Q @1.7GHZ;.078 DCR;1.1A;0402)
L69  value 15nH  [IND-0402HP]  (hidden comment: INDUCTOR;15NH;2%;3.9GHZ SRF;85Q @1.7GHZ;.078 DCR;1.1A;0402)
L71  value 15nH  [IND-0402HP]  (hidden comment: INDUCTOR;15NH;2%;3.9GHZ SRF;85Q @1.7GHZ;.078 DCR;1.1A;0402)
L73  value 15nH  [IND-0402HP]  (hidden comment: INDUCTOR;15NH;2%;3.9GHZ SRF;85Q @1.7GHZ;.078 DCR;1.1A;0402)
L76  value 15nH  [IND-0402HP]  (hidden comment: INDUCTOR;15NH;2%;3.9GHZ SRF;85Q @1.7GHZ;.078 DCR;1.1A;0402)
L77  value 15nH  [IND-0402HP]  (hidden comment: INDUCTOR;15NH;2%;3.9GHZ SRF;85Q @1.7GHZ;.078 DCR;1.1A;0402)
L78  NoLoad: N/L  [IND-0402HP]  (hidden comment: INDUCTOR;3.9NH;2%;9.5GHZ SRF;98Q @1.7GHZ;.045 DCR;1.7A;0402)
L79  NoLoad: N/L  [IND-0402HP]  (hidden comment: INDUCTOR;3.9NH;2%;9.5GHZ SRF;98Q @1.7GHZ;.045 DCR;1.7A;0402)
L84  NoLoad: N/L  [IND-0402HP]  (hidden comment: INDUCTOR;3.9NH;2%;9.5GHZ SRF;98Q @1.7GHZ;.045 DCR;1.7A;0402)
L85  NoLoad: N/L  [IND-0402HP]  (hidden comment: INDUCTOR;3.9NH;2%;9.5GHZ SRF;98Q @1.7GHZ;.045 DCR;1.7A;0402)
L88  value 15nH  [IND-0402HP]  (hidden comment: INDUCTOR;15NH;2%;3.9GHZ SRF;85Q @1.7GHZ;.078 DCR;1.1A;0402)
L89  value 40nH  [IND-0402CS]  (hidden comment: INDUCTOR,40 NH SM 0402 PKG)
L90  value 15nH  [IND-0402HP]  (hidden comment: INDUCTOR;15NH;2%;3.9GHZ SRF;85Q @1.7GHZ;.078 DCR;1.1A;0402)
L149  value 15nH  [IND-0402HP]  (hidden comment: INDUCTOR;15NH;2%;3.9GHZ SRF;85Q @1.7GHZ;.078 DCR;1.1A;0402)
L150  value 15nH  [IND-0402HP]  (hidden comment: INDUCTOR;15NH;2%;3.9GHZ SRF;85Q @1.7GHZ;.078 DCR;1.1A;0402)
L151  value 15nH  [IND-0402HP]  (hidden comment: INDUCTOR;15NH;2%;3.9GHZ SRF;85Q @1.7GHZ;.078 DCR;1.1A;0402)
L152  value 15nH  [IND-0402HP]  (hidden comment: INDUCTOR;15NH;2%;3.9GHZ SRF;85Q @1.7GHZ;.078 DCR;1.1A;0402)
L153  NoLoad: N/L  [IND-0402HP]  (hidden comment: INDUCTOR;3.9NH;2%;9.5GHZ SRF;98Q @1.7GHZ;.045 DCR;1.7A;0402)
L154  NoLoad: N/L  [IND-0402HP]  (hidden comment: INDUCTOR;3.9NH;2%;9.5GHZ SRF;98Q @1.7GHZ;.045 DCR;1.7A;0402)
L155  NoLoad: N/L  [IND-0402HP]  (hidden comment: INDUCTOR;3.9NH;2%;9.5GHZ SRF;98Q @1.7GHZ;.045 DCR;1.7A;0402)
L156  value 15nH  [IND-0402HP]  (hidden comment: INDUCTOR;15NH;2%;3.9GHZ SRF;85Q @1.7GHZ;.078 DCR;1.1A;0402)
L157  NoLoad: N/L  [IND-0402HP]  (hidden comment: INDUCTOR;3.9NH;2%;9.5GHZ SRF;98Q @1.7GHZ;.045 DCR;1.7A;0402)
L158  value 15nH  [IND-0402HP]  (hidden comment: INDUCTOR;15NH;2%;3.9GHZ SRF;85Q @1.7GHZ;.078 DCR;1.1A;0402)
L159  value 15nH  [IND-0402HP]  (hidden comment: INDUCTOR;15NH;2%;3.9GHZ SRF;85Q @1.7GHZ;.078 DCR;1.1A;0402)
L160  value 15nH  [IND-0402HP]  (hidden comment: INDUCTOR;15NH;2%;3.9GHZ SRF;85Q @1.7GHZ;.078 DCR;1.1A;0402)
L161  value 15nH  [IND-0402HP]  (hidden comment: INDUCTOR;15NH;2%;3.9GHZ SRF;85Q @1.7GHZ;.078 DCR;1.1A;0402)
L162  value 15nH  [IND-0402HP]  (hidden comment: INDUCTOR;15NH;2%;3.9GHZ SRF;85Q @1.7GHZ;.078 DCR;1.1A;0402)
L206  value 15nH  [IND-0402HP]  (hidden comment: INDUCTOR;15NH;2%;3.9GHZ SRF;85Q @1.7GHZ;.078 DCR;1.1A;0402)
L229  value 15nH  [IND-0402HP]  (hidden comment: INDUCTOR;15NH;2%;3.9GHZ SRF;85Q @1.7GHZ;.078 DCR;1.1A;0402)
L230  value 15nH  [IND-0402HP]  (hidden comment: INDUCTOR;15NH;2%;3.9GHZ SRF;85Q @1.7GHZ;.078 DCR;1.1A;0402)
L231  NoLoad: N/L  [IND-0402HP]  (hidden comment: INDUCTOR;3.9NH;2%;9.5GHZ SRF;98Q @1.7GHZ;.045 DCR;1.7A;0402)
L232  NoLoad: N/L  [IND-0402HP]  (hidden comment: INDUCTOR;3.9NH;2%;9.5GHZ SRF;98Q @1.7GHZ;.045 DCR;1.7A;0402)
L233  NoLoad: N/L  [IND-0402HP]  (hidden comment: INDUCTOR;3.9NH;2%;9.5GHZ SRF;98Q @1.7GHZ;.045 DCR;1.7A;0402)
L234  NoLoad: N/L  [IND-0402HP]  (hidden comment: INDUCTOR;3.9NH;2%;9.5GHZ SRF;98Q @1.7GHZ;.045 DCR;1.7A;0402)
L235  value 15nH  [IND-0402HP]  (hidden comment: INDUCTOR;15NH;2%;3.9GHZ SRF;85Q @1.7GHZ;.078 DCR;1.1A;0402)
L236  value 15nH  [IND-0402HP]  (hidden comment: INDUCTOR;15NH;2%;3.9GHZ SRF;85Q @1.7GHZ;.078 DCR;1.1A;0402)
L237  value 15nH  [IND-0402HP]  (hidden comment: INDUCTOR;15NH;2%;3.9GHZ SRF;85Q @1.7GHZ;.078 DCR;1.1A;0402)
L238  value 15nH  [IND-0402HP]  (hidden comment: INDUCTOR;15NH;2%;3.9GHZ SRF;85Q @1.7GHZ;.078 DCR;1.1A;0402)
L239  value 15nH  [IND-0402HP]  (hidden comment: INDUCTOR;15NH;2%;3.9GHZ SRF;85Q @1.7GHZ;.078 DCR;1.1A;0402)
L240  NoLoad: N/L  [IND-0402HP]  (hidden comment: INDUCTOR;3.9NH;2%;9.5GHZ SRF;98Q @1.7GHZ;.045 DCR;1.7A;0402)
L241  NoLoad: N/L  [IND-0402HP]  (hidden comment: INDUCTOR;3.9NH;2%;9.5GHZ SRF;98Q @1.7GHZ;.045 DCR;1.7A;0402)
L242  NoLoad: N/L  [IND-0402HP]  (hidden comment: INDUCTOR;3.9NH;2%;9.5GHZ SRF;98Q @1.7GHZ;.045 DCR;1.7A;0402)
L243  NoLoad: N/L  [IND-0402HP]  (hidden comment: INDUCTOR;3.9NH;2%;9.5GHZ SRF;98Q @1.7GHZ;.045 DCR;1.7A;0402)
L244  value 15nH  [IND-0402HP]  (hidden comment: INDUCTOR;15NH;2%;3.9GHZ SRF;85Q @1.7GHZ;.078 DCR;1.1A;0402)
L245  value 15nH  [IND-0402HP]  (hidden comment: INDUCTOR;15NH;2%;3.9GHZ SRF;85Q @1.7GHZ;.078 DCR;1.1A;0402)
L246  value 15nH  [IND-0402HP]  (hidden comment: INDUCTOR;15NH;2%;3.9GHZ SRF;85Q @1.7GHZ;.078 DCR;1.1A;0402)
L247  value 15nH  [IND-0402HP]  (hidden comment: INDUCTOR;15NH;2%;3.9GHZ SRF;85Q @1.7GHZ;.078 DCR;1.1A;0402)
L248  value 15nH  [IND-0402HP]  (hidden comment: INDUCTOR;15NH;2%;3.9GHZ SRF;85Q @1.7GHZ;.078 DCR;1.1A;0402)
L249  value 15nH  [IND-0402HP]  (hidden comment: INDUCTOR;15NH;2%;3.9GHZ SRF;85Q @1.7GHZ;.078 DCR;1.1A;0402)
L250  value 15nH  [IND-0402HP]  (hidden comment: INDUCTOR;15NH;2%;3.9GHZ SRF;85Q @1.7GHZ;.078 DCR;1.1A;0402)
L504  value 390nH  [IND-0603CS]  (hidden comment: INDUCTOR;390NH;5%;.78GHZ SRF;25Q;4.35 DCR;100MA;WIREWOUND;0603)
R2  value 11.3  [RES-0603-N]  (hidden comment: 11.3 OHM 1% FILM SMT)
R6  value 49.9  [RES-0402-N]  (hidden comment: 49.9 OHMS;.06W;1%;200PPM;FILM;CHIP;0402)
R7  value 49.9  [RES-0402-N]  (hidden comment: 49.9 OHMS;.06W;1%;200PPM;FILM;CHIP;0402)
R10  value 24.9  [RES-0402-N]  (hidden comment: 24.9 OHMS;.06W;1%;200PPM;FILM;CHIP;0402)
R11  value 0  [RES-0603-N]  (hidden comment: JUMPER;.05 OHMS MAX;1A MAX;0603)
R14  value 0  [RES-0603-N]  (hidden comment: JUMPER;.05 OHMS MAX;1A MAX;0603)
R53  value 0  [RES-0603-N]  (hidden comment: JUMPER;.05 OHMS MAX;1A MAX;0603)
R54  value 0  [RES-0603-N]  (hidden comment: JUMPER;.05 OHMS MAX;1A MAX;0603)
R57  value 0  [RES-0603-N]  (hidden comment: JUMPER;.05 OHMS MAX;1A MAX;0603)
R58  value 0  [RES-0603-N]  (hidden comment: JUMPER;.05 OHMS MAX;1A MAX;0603)
R64  value 24.9  [RES-0402-N]  (hidden comment: 24.9 OHMS;.06W;1%;200PPM;FILM;CHIP;0402)
R65  value 20  [RES-0201-N]  (hidden comment: 20 OHMS;.05W;1%;200PPM;FILM CHIP;0201)
R66  value 20  [RES-0201-N]  (hidden comment: 20 OHMS;.05W;1%;200PPM;FILM CHIP;0201)
R69  value 49.9  [RES-0402-N]  (hidden comment: 49.9 OHMS;.06W;1%;200PPM;FILM;CHIP;0402)
R74  value 49.9  [RES-0402-N]  (hidden comment: 49.9 OHMS;.06W;1%;200PPM;FILM;CHIP;0402)
R76  value 24.9  [RES-0402-N]  (hidden comment: 24.9 OHMS;.06W;1%;200PPM;FILM;CHIP;0402)
R77  value 24.9  [RES-0402-N]  (hidden comment: 24.9 OHMS;.06W;1%;200PPM;FILM;CHIP;0402)
R80  value 24.9  [RES-0402-N]  (hidden comment: 24.9 OHMS;.06W;1%;200PPM;FILM;CHIP;0402)
R83  value 24.9  [RES-0402-N]  (hidden comment: 24.9 OHMS;.06W;1%;200PPM;FILM;CHIP;0402)
R87  value 24.9  [RES-0402-N]  (hidden comment: 24.9 OHMS;.06W;1%;200PPM;FILM;CHIP;0402)
R88  value 20  [RES-0201-N]  (hidden comment: 20 OHMS;.05W;1%;200PPM;FILM CHIP;0201)
R91  value 20  [RES-0201-N]  (hidden comment: 20 OHMS;.05W;1%;200PPM;FILM CHIP;0201)
R95  value 24.9  [RES-0402-N]  (hidden comment: 24.9 OHMS;.06W;1%;200PPM;FILM;CHIP;0402)
R96  value 24.9  [RES-0402-N]  (hidden comment: 24.9 OHMS;.06W;1%;200PPM;FILM;CHIP;0402)
R97  value 24.9  [RES-0402-N]  (hidden comment: 24.9 OHMS;.06W;1%;200PPM;FILM;CHIP;0402)
R99  value 49.9  [RES-0402-N]  (hidden comment: 49.9 OHMS;.06W;1%;200PPM;FILM;CHIP;0402)
R100  value 49.9  [RES-0402-N]  (hidden comment: 49.9 OHMS;.06W;1%;200PPM;FILM;CHIP;0402)
R102  value 24.9  [RES-0402-N]  (hidden comment: 24.9 OHMS;.06W;1%;200PPM;FILM;CHIP;0402)
R112  value 24.9  [RES-0402-N]  (hidden comment: 24.9 OHMS;.06W;1%;200PPM;FILM;CHIP;0402)
R113  value 20  [RES-0201-N]  (hidden comment: 20 OHMS;.05W;1%;200PPM;FILM CHIP;0201)
R114  value 20  [RES-0201-N]  (hidden comment: 20 OHMS;.05W;1%;200PPM;FILM CHIP;0201)
R115  value 24.9  [RES-0402-N]  (hidden comment: 24.9 OHMS;.06W;1%;200PPM;FILM;CHIP;0402)
R118  value 49.9  [RES-0402-N]  (hidden comment: 49.9 OHMS;.06W;1%;200PPM;FILM;CHIP;0402)
R275  value 49.9  [RES-0402-N]  (hidden comment: 49.9 OHMS;.06W;1%;200PPM;FILM;CHIP;0402)
R291  value 24.9  [RES-0402-N]  (hidden comment: 24.9 OHMS;.06W;1%;200PPM;FILM;CHIP;0402)
R292  value 24.9  [RES-0402-N]  (hidden comment: 24.9 OHMS;.06W;1%;200PPM;FILM;CHIP;0402)
R293  value 24.9  [RES-0402-N]  (hidden comment: 24.9 OHMS;.06W;1%;200PPM;FILM;CHIP;0402)
R294  value 24.9  [RES-0402-N]  (hidden comment: 24.9 OHMS;.06W;1%;200PPM;FILM;CHIP;0402)
R295  value 20  [RES-0201-N]  (hidden comment: 20 OHMS;.05W;1%;200PPM;FILM CHIP;0201)
R296  value 20  [RES-0201-N]  (hidden comment: 20 OHMS;.05W;1%;200PPM;FILM CHIP;0201)
R297  value 24.9  [RES-0402-N]  (hidden comment: 24.9 OHMS;.06W;1%;200PPM;FILM;CHIP;0402)
R298  value 49.9  [RES-0402-N]  (hidden comment: 49.9 OHMS;.06W;1%;200PPM;FILM;CHIP;0402)
R299  value 49.9  [RES-0402-N]  (hidden comment: 49.9 OHMS;.06W;1%;200PPM;FILM;CHIP;0402)
R300  value 24.9  [RES-0402-N]  (hidden comment: 24.9 OHMS;.06W;1%;200PPM;FILM;CHIP;0402)
R301  value 24.9  [RES-0402-N]  (hidden comment: 24.9 OHMS;.06W;1%;200PPM;FILM;CHIP;0402)
R302  value 24.9  [RES-0402-N]  (hidden comment: 24.9 OHMS;.06W;1%;200PPM;FILM;CHIP;0402)
R303  value 24.9  [RES-0402-N]  (hidden comment: 24.9 OHMS;.06W;1%;200PPM;FILM;CHIP;0402)
R304  value 20  [RES-0201-N]  (hidden comment: 20 OHMS;.05W;1%;200PPM;FILM CHIP;0201)
R305  value 20  [RES-0201-N]  (hidden comment: 20 OHMS;.05W;1%;200PPM;FILM CHIP;0201)
R306  value 49.9  [RES-0402-N]  (hidden comment: 49.9 OHMS;.06W;1%;200PPM;FILM;CHIP;0402)
R307  value 49.9  [RES-0402-N]  (hidden comment: 49.9 OHMS;.06W;1%;200PPM;FILM;CHIP;0402)
R308  value 24.9  [RES-0402-N]  (hidden comment: 24.9 OHMS;.06W;1%;200PPM;FILM;CHIP;0402)
R309  value 24.9  [RES-0402-N]  (hidden comment: 24.9 OHMS;.06W;1%;200PPM;FILM;CHIP;0402)
R310  value 20  [RES-0201-N]  (hidden comment: 20 OHMS;.05W;1%;200PPM;FILM CHIP;0201)
R311  value 20  [RES-0201-N]  (hidden comment: 20 OHMS;.05W;1%;200PPM;FILM CHIP;0201)
R316  value 11.3  [RES-0603-N]  (hidden comment: 11.3 OHM 1% FILM SMT)
R671  value 39.2  [RES-2010-N]  (hidden comment: 39.2 OHM;.75W;1%;100PPM;FILM CHIP;2010)
R672  value 107  [RES-2010-N]  (hidden comment: 107 OHMS;0.75W;1%;100PPM;THICK FILM;CHIP;2010;RoHS)
R781  value 49.9  [RES-2010-N]  (hidden comment: 49.9 OHMS;.5W;1%;100PPM;THICK FILM;CHIP;2010;RoHS)
R782  value 49.9  [RES-2010-N]  (hidden comment: 49.9 OHMS;.5W;1%;100PPM;THICK FILM;CHIP;2010;RoHS)
U4  M_PN: HMC232LP4E  [QFN-24_HITTITE]  (hidden comment: MMIC SPDT;NON-REFLECTIVE;SWITCH;DC -12 GHz;RoHS)
U7  M_PN: HMC232LP4E  [QFN-24_HITTITE]  (hidden comment: MMIC SPDT;NON-REFLECTIVE;SWITCH;DC -12 GHz;RoHS)
U8  M_PN: HMC232LP4E  [QFN-24_HITTITE]  (hidden comment: MMIC SPDT;NON-REFLECTIVE;SWITCH;DC -12 GHz;RoHS)
U9  M_PN: HMC232LP4E  [QFN-24_HITTITE]  (hidden comment: MMIC SPDT;NON-REFLECTIVE;SWITCH;DC -12 GHz;RoHS)
U10  M_PN: HMC232LP4E  [QFN-24_HITTITE]  (hidden comment: MMIC SPDT;NON-REFLECTIVE;SWITCH;DC -12 GHz;RoHS)
U13  M_PN: HMC232LP4E  [QFN-24_HITTITE]  (hidden comment: MMIC SPDT;NON-REFLECTIVE;SWITCH;DC -12 GHz;RoHS)
U15  M_PN: MASWCC0006  [QFN36_MACOM]  (hidden comment: SWITCH;SP6T;DC-4GHZ;25DB ISO;20NS;27DBM P1;PQFN-36)
U17  M_PN: MASWCC0006  [QFN36_MACOM]  (hidden comment: SWITCH;SP6T;DC-4GHZ;25DB ISO;20NS;27DBM P1;PQFN-36)
U18  M_PN: HMC232LP4E  [QFN-24_HITTITE]  (hidden comment: MMIC SPDT;NON-REFLECTIVE;SWITCH;DC -12 GHz;RoHS)
U20  M_PN: HMC232LP4E  [QFN-24_HITTITE]  (hidden comment: MMIC SPDT;NON-REFLECTIVE;SWITCH;DC -12 GHz;RoHS)
U22  M_PN: HMC232LP4E  [QFN-24_HITTITE]  (hidden comment: MMIC SPDT;NON-REFLECTIVE;SWITCH;DC -12 GHz;RoHS)
U23  M_PN: HMC232LP4E  [QFN-24_HITTITE]  (hidden comment: MMIC SPDT;NON-REFLECTIVE;SWITCH;DC -12 GHz;RoHS)
U25  M_PN: HMC232LP4E  [QFN-24_HITTITE]  (hidden comment: MMIC SPDT;NON-REFLECTIVE;SWITCH;DC -12 GHz;RoHS)
U31  AMP;0-6GHZ;20DB;+20DBM;5V;100MA;SOT-89  [SOT-89]  (value not drawn)
U33  AMP;0-6GHZ;20DB;+20DBM;5V;100MA;SOT-89  [SOT-89]  (value not drawn)
U35  M_PN: HMC232LP4E  [QFN-24_HITTITE]  (hidden comment: MMIC SPDT;NON-REFLECTIVE;SWITCH;DC -12 GHz;RoHS)
U82  M_PN: LT5579IUH#PBF  [QFN-24_LT]  (hidden comment: MIXER;1.5-3.8GHZ;+2DBM;0-1GHZ IF;QFN-24)
U169  AMP;50-1000MHZ;12DB;+18DBM;5.5V;60MA;4.4DB NF;RRR137 PKG  [RRR137]  (value not drawn)
X5  XFORMER;1:4Z CT;2-800MHZ; .25W;240MA;.15"x.15"  [SM-22_Macomtech]  (value not drawn)

## Ports
BANK_1_NEG, BANK_1_POS, BANK_2_NEG, BANK_2_POS, BANK_3_NEG, BANK_3_POS, BANK_4_NEG, BANK_4_POS, BANK_5_NEG, BANK_5_POS, BANK_6_NEG, BANK_6_POS, STALO_LO, STALO_p2-p3, ~{BANK_1_NEG}, ~{BANK_2_NEG}, ~{BANK_3_NEG}, ~{BANK_4_NEG}, ~{BANK_5_NEG}, ~{BANK_6_NEG}

## Nets
+3.3V_ST: C891.1 C892.2 FL22.3(OUT)
+5V_ST: C190.1 C196.2 C365.1 C823.1 FT18.1 L19.1 L77.2
+8V_ST: C361.1 C727.1 C961.1 C962.1 FT33.1 R671.2 R672.2
+12V_b: C1224.1 C1226.1 R781.1
-5V_ST: C189.1 C195.2 C367.1 C825.1 FT7.1 L20.1 L76.2
GND: AT2.2(GND) AT4.2(GND) AT5.2(GND) AT7.2(GND) AT8.2(GND) AT9.2(GND) AT11.2(GND) AT13.2(GND) AT15.2(GND) AT53.2(GND) AT54.2(GND) AT55.2(GND) AT57.2(GND) AT59.2(GND) AT61.2(GND) AT62.2(GND) C102.2 C103.2 C104.2 C105.2 C106.2 C107.2 C108.2 C109.2 C115.2 C117.2 C118.2 C148.2 C149.2 C150.2 C151.2 C152.2 C175.2 C176.2 C177.2 C178.2 C179.2 C180.2 C181.2 C182.2 C183.2 C184.2 C185.2 C186.2 C189.2 C190.2 C191.1 C192.1 C193.1 C195.1 C196.1 C197.1 C198.1 C199.1 C232.1 C233.2 C234.2 C241.2 C253.2 C254.2 C255.2 C256.2 C259.2 C351.2 C352.2 C353.2 C354.2 C355.2 C356.2 C357.2 C361.2 C365.2 C366.2 C367.2 C399.2 C400.1 C727.2 C730.1 C823.2 C825.2 C826.2 C827.1 C832.2 C833.1 C834.2 C835.2 C836.2 C837.2 C838.2 C839.1 C840.2 C841.2 C842.2 C843.2 C846.2 C847.1 C849.2 C854.1 C855.2 C856.1 C857.2 C858.2 C859.2 C860.2 C861.2 C862.2 C863.2 C864.2 C872.2 C873.2 C874.2 C875.2 C876.2 C877.2 C878.2 C879.2 C884.1 C886.2 C887.1 C888.1 C889.1 C890.1 C891.2 C892.1 C893.2 C952.1 C953.1 C954.2 C955.2 C961.2 C962.2 C963.1 C964.1 C965.1 C966.2 C967.2 C969.2 C970.2 C1224.2 C1225.2 C1226.2 C1227.2 FL11.2(GND) FL22.2(GND) FL23.2(GND) FL27.3(GND) FL27.4(GND) FL27.5(GND) FL27.6(GND) FL27.7(GND) FL27.8(GND) FL27.9(GND) FL27.10(GND) FL28.3(GND) FL28.4(GND) FL28.5(GND) FL28.6(GND) FL28.7(GND) FL28.8(GND) FL28.9(GND) FL28.10(GND) FL29.3(GND) FL29.4(GND) FL29.5(GND) FL29.6(GND) FL29.7(GND) FL29.8(GND) FL29.9(GND) FL29.10(GND) FL33.3(GND) FL33.4(GND) FL33.5(GND) FL33.6(GND) FL33.7(GND) FL33.8(GND) FL33.9(GND) FL33.10(GND) FL34.3(GND) FL34.4(GND) FL34.5(GND) FL34.6(GND) FL34.7(GND) FL34.8(GND) FL34.9(GND) FL34.10(GND) FL37.3(GND) FL37.4(GND) FL37.5(GND) FL37.6(GND) FL37.7(GND) FL37.8(GND) FL37.9(GND) FL37.10(GND) FL39.2(OUT) FL39.4(GND) FL43.3(GND) FL43.4(GND) FL43.5(GND) FL43.6(GND) FL43.7(GND) FL43.8(GND) FL43.9(GND) FL43.10(GND) FL45.2(GND) FL47.2(GND) FL48.2(OUT) FL48.4(GND) FL49.2(GND) FL50.2(GND) FL51.2(GND) FL151.3(GND) FL151.4(GND) FL151.5(GND) FL151.6(GND) FL151.7(GND) FL151.8(GND) FL151.9(GND) FL151.10(GND) FL152.3(GND) FL152.4(GND) FL152.5(GND) FL152.6(GND) FL152.7(GND) FL152.8(GND) FL152.9(GND) FL152.10(GND) FL153.3(GND) FL153.4(GND) FL153.5(GND) FL153.6(GND) FL153.7(GND) FL153.8(GND) FL153.9(GND) FL153.10(GND) FL173.3(GND) FL173.4(GND) FL173.5(GND) FL173.6(GND) FL173.7(GND) FL173.8(GND) FL173.9(GND) FL173.10(GND) FL190.3(GND) FL190.4(GND) FL190.5(GND) FL190.6(GND) FL190.7(GND) FL190.8(GND) FL190.9(GND) FL190.10(GND) FL500.2(GND) FL501.2(GND) FL506.2(GND) J2.2(GND) J25.2(GND) L8.1 L9.1 L10.1 L11.1 L17.1 L18.1 L54.1 L55.1 L78.1 L79.1 L84.1 L85.1 L153.1 L154.1 L155.1 L157.1 L231.1 L232.1 L233.1 L234.1 L240.1 L241.1 L242.1 L243.1 R2.1 R6.2 R7.2 R69.2 R74.2 R99.2 R100.2 R118.2 R275.2 R298.2 R299.2 R306.2 R307.2 R316.2 U4.1(Vdd) U4.2(Vctl) U4.3(G) U4.5(G) U4.6(NC) U4.7(NC) U4.8(G) U4.10(G) U4.11(NC) U4.12(RF2) U4.13(NC) U4.14(NC) U4.17(NC) U4.18(NC) U4.19(NC) U4.20(NC) U4.21(G) U4.23(G) U4.24(NC) U4.25(G) U7.1(Vdd) U7.2(Vctl) U7.3(G) U7.5(G) U7.6(NC) U7.7(NC) U7.8(G) U7.10(G) U7.11(NC) U7.12(RF2) U7.13(NC) U7.14(NC) U7.17(NC) U7.18(NC) U7.19(NC) U7.20(NC) U7.21(G) U7.23(G) U7.24(NC) U7.25(G) U8.1(Vdd) U8.2(Vctl) U8.3(G) U8.5(G) U8.6(NC) U8.7(NC) U8.8(G) U8.10(G) U8.11(NC) U8.12(RF2) U8.13(NC) U8.14(NC) U8.17(NC) U8.18(NC) U8.19(NC) U8.20(NC) U8.21(G) U8.23(G) U8.24(NC) U8.25(G) U9.1(Vdd) U9.2(Vctl) U9.3(G) U9.5(G) U9.6(NC) U9.7(NC) U9.8(G) U9.10(G) U9.11(NC) U9.12(RF2) U9.13(NC) U9.14(NC) U9.17(NC) U9.18(NC) U9.19(NC) U9.20(NC) U9.21(G) U9.23(G) U9.24(NC) U9.25(G) U10.1(Vdd) U10.2(Vctl) U10.3(G) U10.5(G) U10.6(NC) U10.7(NC) U10.8(G) U10.10(G) U10.11(NC) U10.12(RF2) U10.13(NC) U10.14(NC) U10.17(NC) U10.18(NC) U10.19(NC) U10.20(NC) U10.21(G) U10.23(G) U10.24(NC) U10.25(G) U13.1(Vdd) U13.2(Vctl) U13.3(G) U13.5(G) U13.6(NC) U13.7(NC) U13.8(G) U13.10(G) U13.11(NC) U13.12(RF2) U13.13(NC) U13.14(NC) U13.17(NC) U13.18(NC) U13.19(NC) U13.20(NC) U13.21(G) U13.23(G) U13.24(NC) U13.25(G) U15.11(GND) U15.13(GND) U15.15(GND) U15.17(GND) U15.19(GND) U15.21(GND) U15.23(GND) U15.24(GND) U15.26(GND) U15.28(GND) U15.30(GND) U15.37(GND) U17.11(GND) U17.13(GND) U17.15(GND) U17.17(GND) U17.19(GND) U17.21(GND) U17.23(GND) U17.24(GND) U17.26(GND) U17.28(GND) U17.30(GND) U17.37(GND) U18.1(Vdd) U18.2(Vctl) U18.3(G) U18.5(G) U18.6(NC) U18.7(NC) U18.8(G) U18.10(G) U18.11(NC) U18.12(RF2) U18.13(NC) U18.14(NC) U18.17(NC) U18.18(NC) U18.19(NC) U18.20(NC) U18.21(G) U18.23(G) U18.24(NC) U18.25(G) U20.1(Vdd) U20.2(Vctl) U20.3(G) U20.5(G) U20.6(NC) U20.7(NC) U20.8(G) U20.10(G) U20.11(NC) U20.12(RF2) U20.13(NC) U20.14(NC) U20.17(NC) U20.18(NC) U20.19(NC) U20.20(NC) U20.21(G) U20.23(G) U20.24(NC) U20.25(G) U22.1(Vdd) U22.2(Vctl) U22.3(G) U22.5(G) U22.6(NC) U22.7(NC) U22.8(G) U22.10(G) U22.11(NC) U22.12(RF2) U22.13(NC) U22.14(NC) U22.17(NC) U22.18(NC) U22.19(NC) U22.20(NC) U22.21(G) U22.23(G) U22.24(NC) U22.25(G) U23.1(Vdd) U23.2(Vctl) U23.3(G) U23.5(G) U23.6(NC) U23.7(NC) U23.8(G) U23.10(G) U23.11(NC) U23.12(RF2) U23.13(NC) U23.14(NC) U23.17(NC) U23.18(NC) U23.19(NC) U23.20(NC) U23.21(G) U23.23(G) U23.24(NC) U23.25(G) U25.1(Vdd) U25.2(Vctl) U25.3(G) U25.5(G) U25.6(NC) U25.7(NC) U25.8(G) U25.10(G) U25.11(NC) U25.12(RF2) U25.13(NC) U25.14(NC) U25.17(NC) U25.18(NC) U25.19(NC) U25.20(NC) U25.21(G) U25.23(G) U25.24(NC) U25.25(G) U31.2(GND) U31.4 U33.2(GND) U33.4 U35.1(Vdd) U35.2(Vctl) U35.3(G) U35.5(G) U35.6(NC) U35.7(NC) U35.8(G) U35.10(G) U35.11(NC) U35.12(RF2) U35.13(NC) U35.14(NC) U35.17(NC) U35.18(NC) U35.19(NC) U35.20(NC) U35.21(G) U35.23(G) U35.24(NC) U35.25(G) U82.1(G) U82.2(G) U82.5(G) U82.6(G) U82.7(G) U82.12(G) U82.13(G) U82.14(G) U82.16(G) U82.17(G) U82.18(G) U82.19(G) U82.20(G) U82.21(G) U82.23(G) U82.24(G) U82.25(G) U169.2(GND) U169.4(GND) X5.1(Pri+)
~{BANK_1_NEG}: C233.1 C357.1 R102.1 R113.1 ; port ~{BANK_1_NEG}
~{BANK_2_NEG}: C840.1 C842.1 R293.1 R295.1 ; port ~{BANK_2_NEG}
~{BANK_3_NEG}: C180.1 C182.1 R83.1 R88.1 ; port ~{BANK_3_NEG}
~{BANK_4_NEG}: C861.1 C863.1 R302.1 R304.1 ; port ~{BANK_4_NEG}
~{BANK_5_NEG}: C106.1 C108.1 R10.1 R65.1 ; port ~{BANK_5_NEG}
~{BANK_6_NEG}: C876.1 C878.1 R308.1 R310.1 ; port ~{BANK_6_NEG}
BANK_1_NEG: C356.1 C399.1 R112.1 R114.1 ; port BANK_1_NEG
BANK_1_POS: C184.1 C855.1 L69.1 L235.1 ; port BANK_1_POS
BANK_2_NEG: C841.1 C843.1 R294.1 R296.1 ; port BANK_2_NEG
BANK_2_POS: C175.1 C826.1 L68.1 L152.1 ; port BANK_2_POS
BANK_3_NEG: C181.1 C183.1 R87.1 R91.1 ; port BANK_3_NEG
BANK_3_POS: C185.1 L71.1 R57.1 ; port BANK_3_POS
BANK_4_NEG: C862.1 C864.1 R303.1 R305.1 ; port BANK_4_NEG
BANK_4_POS: C118.1 L67.1 R54.1 ; port BANK_4_POS
BANK_5_NEG: C107.1 C109.1 R64.1 R66.1 ; port BANK_5_NEG
BANK_5_POS: C186.1 L73.1 R58.1 ; port BANK_5_POS
BANK_6_NEG: C877.1 C879.1 R309.1 R311.1 ; port BANK_6_NEG
BANK_6_POS: C117.1 L66.1 R53.1 ; port BANK_6_POS
STALO_LO: AT62.1(IN/OUT) ; port STALO_LO
STALO_p2-p3: FL48.3(GND) ; port STALO_p2-p3
NetAT2_1: AT2.1(IN/OUT) FL27.1(IN) L8.2
NetAT2_3: AT2.3(IN/OUT) FL28.2(OUT) L11.2
NetAT4_1: AT4.1(IN/OUT) FL28.1(IN) L9.2
NetAT4_3: AT4.3(IN/OUT) C29.1
NetAT5_1: AT5.1(IN/OUT) FL29.1(IN) L18.2
NetAT5_3: AT5.3(IN/OUT) FL33.2(OUT) L55.2
NetAT7_1: AT7.1(IN/OUT) FL33.1(IN) L54.2
NetAT7_3: AT7.3(IN/OUT) C116.1
NetAT8_1: AT8.1(IN/OUT) FL37.1(IN) L84.2
NetAT8_3: AT8.3(IN/OUT) C203.1
NetAT9_1: AT9.1(IN/OUT) FL34.1(IN) L79.2
NetAT9_3: AT9.3(IN/OUT) FL37.2(OUT) L85.2
NetAT11_1: AT11.1(IN/OUT) FL43.1(IN) L154.2
NetAT11_3: AT11.3(IN/OUT) FL151.2(OUT) L157.2
NetAT13_1: AT13.1(IN/OUT) FL151.1(IN) L155.2
NetAT13_3: AT13.3(IN/OUT) C831.1
NetAT15_1: AT15.1(IN/OUT) FL152.1(IN) L232.2
NetAT15_3: AT15.3(IN/OUT) FL153.2(OUT) L234.2
NetAT53_1: AT53.1(IN/OUT) FL153.1(IN) L233.2
NetAT53_3: AT53.3(IN/OUT) C853.1
NetAT54_1: AT54.1(IN/OUT) FL173.1(IN) L241.2
NetAT54_3: AT54.3(IN/OUT) FL190.2(OUT) L243.2
NetAT55_1: AT55.1(IN/OUT) FL190.1(IN) L242.2
NetAT55_3: AT55.3(IN/OUT) C871.1
NetAT57_1: AT57.1(IN/OUT) C1228.2
NetAT57_3: AT57.3(IN/OUT) X5.3(Pri-)
NetAT59_1: AT59.1(IN/OUT) C958.1
NetAT59_3: AT59.3(IN/OUT) C957.2
NetAT61_1: AT61.1(IN/OUT) C1229.1
NetAT61_3: AT61.3(IN/OUT) J2.1(CNTR)
NetAT62_3: AT62.3(IN/OUT) C722.2
NetC18_1: C18.1 U7.4(NC)
NetC18_2: C18.2 U15.25(RF4)
NetC20_1: C20.1 U17.18(RF3)
NetC20_2: C20.2 U4.9(RF1)
NetC25_1: C25.1 U4.4(NC)
NetC25_2: C25.2 FL27.2(OUT) L10.2
NetC29_2: C29.2 U7.9(RF1)
NetC102_1: C102.1 L12.2 U4.15(B)
NetC103_1: C103.1 L13.2 U4.16(A)
NetC104_1: C104.1 L15.2 U7.15(B)
NetC105_1: C105.1 L16.2 U7.16(A)
NetC111_1: C111.1 U9.4(NC)
NetC111_2: C111.2 U15.27(RF5)
NetC113_1: C113.1 U17.16(RF2)
NetC113_2: C113.2 U8.9(RF1)
NetC114_1: C114.1 U8.4(NC)
NetC114_2: C114.2 FL29.2(OUT) L17.2
NetC115_1: C115.1 FL11.1(IN) L90.2
NetC116_2: C116.2 U9.9(RF1)
NetC148_1: C148.1 C191.2 R76.2 U17.6(C4)
NetC149_1: C149.1 C192.2 R77.2 U17.5(C5)
NetC150_1: C150.1 C193.2 R80.2 U17.4(C6)
NetC151_1: C151.1 C197.2 R95.2 U17.9(C1)
NetC152_1: C152.1 C198.2 R96.2 U17.8(C2)
NetC176_1: C176.1 L56.2 U8.15(B)
NetC177_1: C177.1 L57.2 U8.16(A)
NetC178_1: C178.1 L59.2 U9.15(B)
NetC179_1: C179.1 L65.2 U9.16(A)
NetC188_1: C188.1 U13.4(NC)
NetC188_2: C188.2 U15.29(RF6)
NetC199_2: C199.2 C241.1 R97.2 U17.7(C3)
NetC200_1: C200.1 U17.14(RF1)
NetC200_2: C200.2 U10.9(RF1)
NetC201_1: C201.1 U10.4(NC)
NetC201_2: C201.2 FL34.2(OUT) L78.2
NetC203_2: C203.2 U13.9(RF1)
NetC232_2: C232.2 L76.1 U15.32(VEE)
NetC234_1: C234.1 L88.2 U10.15(B)
NetC253_1: C253.1 C827.2 R115.2 U15.9(C1)
NetC254_1: C254.1 C833.2 R291.2 U15.8(C2)
NetC255_1: C255.1 C839.2 R292.2 U15.7(C3)
NetC256_1: C256.1 C847.2 R297.2 U15.6(C4)
NetC259_1: C259.1 C854.2 R300.2 U15.5(C5)
NetC351_1: C351.1 C856.2 R301.2 U15.4(C6)
NetC352_1: C352.1 L19.2 U17.33(VCC)
NetC353_1: C353.1 L149.2 U10.16(A)
NetC354_1: C354.1 L150.2 U13.15(B)
NetC355_1: C355.1 L151.2 U13.16(A)
NetC366_1: C366.1 L20.2 U17.32(VEE)
NetC400_2: C400.2 L77.1 U15.33(VCC)
NetC401_1: C401.1 U15.22(RFC)
NetC401_2: C401.2 FL39.1(IN)
NetC402_1: C402.1 FL39.3(GND)
NetC402_2: C402.2 C956.1 C959.2
NetC722_1: C722.1 U82.22(LO)
NetC730_2: C730.2 FL23.3(OUT) FL45.3(OUT)
NetC822_1: C822.1 U20.4(NC)
NetC822_2: C822.2 U15.14(RF1)
NetC828_1: C828.1 U17.29(RF6)
NetC828_2: C828.2 U18.9(RF1)
NetC829_1: C829.1 U18.4(NC)
NetC829_2: C829.2 FL43.2(OUT) L153.2
NetC831_2: C831.2 U20.9(RF1)
NetC832_1: C832.1 L156.1 R54.2
NetC834_1: C834.1 L158.1 R11.2
NetC835_1: C835.1 L159.2 U18.15(B)
NetC836_1: C836.1 L160.2 U18.16(A)
NetC837_1: C837.1 L161.2 U20.15(B)
NetC838_1: C838.1 L162.2 U20.16(A)
NetC845_1: C845.1 U23.4(NC)
NetC845_2: C845.2 U15.16(RF2)
NetC846_1: C846.1 L229.1 R14.2
NetC849_1: C849.1 L230.1 R57.2
NetC850_1: C850.1 U17.27(RF5)
NetC850_2: C850.2 U22.9(RF1)
NetC851_1: C851.1 U22.4(NC)
NetC851_2: C851.2 FL152.2(OUT) L231.2
NetC853_2: C853.2 U23.9(RF1)
NetC857_1: C857.1 L236.2 U22.15(B)
NetC858_1: C858.1 L237.2 U22.16(A)
NetC859_1: C859.1 L238.2 U23.15(B)
NetC860_1: C860.1 L239.2 U23.16(A)
NetC866_1: C866.1 U35.4(NC)
NetC866_2: C866.2 U15.18(RF3)
NetC868_1: C868.1 U17.25(RF4)
NetC868_2: C868.2 U25.9(RF1)
NetC869_1: C869.1 U25.4(NC)
NetC869_2: C869.2 FL173.2(OUT) L240.2
NetC871_2: C871.2 U35.9(RF1)
NetC872_1: C872.1 L244.2 U25.15(B)
NetC873_1: C873.1 L245.2 U25.16(A)
NetC874_1: C874.1 L246.2 U35.15(B)
NetC875_1: C875.1 L247.2 U35.16(A)
NetC880_1: C880.1 X5.4(Sec-)
NetC880_2: C880.2 C882.2 C883.2 L5.2 U82.3(IF+)
NetC881_1: C881.1 U17.22(RFC)
NetC881_2: C881.2 C884.2 U82.15(RF)
NetC882_1: C882.1 C883.1 C885.2 L89.1 U82.4(IF-)
NetC885_1: C885.1 X5.5(Sec+)
NetC886_1: C886.1 C887.2 C888.2 C889.2 C890.2 L90.1 U82.8(VCC) U82.9(VCC) U82.10(VCC) U82.11(VCC)
NetC893_1: C893.1 FL11.3(OUT) FL22.1(IN)
NetC952_2: C952.2 FL45.1(IN) FL47.3(OUT)
NetC953_2: C953.2 FL47.1(IN) L206.1
NetC954_1: C954.1 FL23.1(IN) R671.1
NetC955_1: C955.1 L206.2 L248.1
NetC956_2: C956.2 U31.1
NetC957_1: C957.1 L248.2 U31.3
NetC958_2: C958.2 U33.1
NetC959_1: C959.1 J25.1(CNTR)
NetC963_2: C963.2 FL49.3(OUT) FL50.3(OUT)
NetC964_2: C964.2 FL50.1(IN) FL51.3(OUT)
NetC965_2: C965.2 FL51.1(IN) L249.1
NetC966_1: C966.1 FL49.1(IN) R672.1
NetC967_1: C967.1 L249.2 L250.1
NetC968_1: C968.1 L250.2 U33.3
NetC968_2: C968.2 FL48.1(IN)
NetC969_1: C969.1 FL500.1(IN) FL501.3(OUT)
NetC970_1: C970.1 FL501.1(IN) R782.2
NetC1225_1: C1225.1 FL500.3(OUT) FL506.1(IN)
NetC1227_1: C1227.1 FL506.3(OUT) L504.1
NetC1228_1: C1228.1 L504.2 U169.3(OUT)
NetC1229_2: C1229.2 U169.1(IN)
NetL5_1: L5.1 R316.1
NetL12_1: L12.1 R10.2
NetL13_1: L13.1 R64.2
NetL15_1: L15.1 R65.2
NetL16_1: L16.1 R66.2
NetL56_1: L56.1 R83.2
NetL57_1: L57.1 R87.2
NetL59_1: L59.1 R88.2
NetL65_1: L65.1 R91.2
NetL66_2: L66.2 R76.1
NetL67_2: L67.2 R77.1
NetL68_2: L68.2 R80.1
NetL69_2: L69.2 R95.1
NetL71_2: L71.2 R96.1
NetL73_2: L73.2 R97.1
NetL88_1: L88.1 R102.2
NetL89_2: L89.2 R2.2
NetL149_1: L149.1 R112.2
NetL150_1: L150.1 R113.2
NetL151_1: L151.1 R114.2
NetL152_2: L152.2 R115.1
NetL156_2: L156.2 R291.1
NetL158_2: L158.2 R292.1
NetL159_1: L159.1 R293.2
NetL160_1: L160.1 R294.2
NetL161_1: L161.1 R295.2
NetL162_1: L162.1 R296.2
NetL229_2: L229.2 R297.1
NetL230_2: L230.2 R300.1
NetL235_2: L235.2 R301.1
NetL236_1: L236.1 R302.2
NetL237_1: L237.1 R303.2
NetL238_1: L238.1 R304.2
NetL239_1: L239.1 R305.2
NetL244_1: L244.1 R308.2
NetL245_1: L245.1 R309.2
NetL246_1: L246.1 R310.2
NetL247_1: L247.1 R311.2
NetR6_1: R6.1 U4.22(RF2)
NetR7_1: R7.1 U7.22(RF2)
NetR11_1: R11.1 R53.2
NetR14_1: R14.1 R58.2
NetR69_1: R69.1 U8.22(RF2)
NetR74_1: R74.1 U9.22(RF2)
NetR99_1: R99.1 U10.22(RF2)
NetR100_1: R100.1 U13.22(RF2)
NetR118_1: R118.1 U18.22(RF2)
NetR275_1: R275.1 U20.22(RF2)
NetR298_1: R298.1 U22.22(RF2)
NetR299_1: R299.1 U23.22(RF2)
NetR306_1: R306.1 U25.22(RF2)
NetR307_1: R307.1 U35.22(RF2)
NetR781_2: R781.2 R782.1

Not connected (* = marked no-connect by the designer): U15 1(CP2) 2(VEE) 3(NC) 10(NC) 12(NC) 20(NC) 31(NC) 34(NC) 35(VCC) 36(CP1); U17 1(CP2) 2(VEE) 3(NC) 10(NC) 12(NC) 20(NC) 31(NC) 34(NC) 35(VCC) 36(CP1); X5 2(SecCT)

## Layout directives
net class GCPW Clearance: NetAT61_3, NetC881_1, NetC959_1
net class 30 mil clearance: NetAT2_1, NetAT2_3, NetAT4_1, NetAT4_3, NetAT5_1, NetAT5_3, NetAT7_1, NetAT7_3, NetAT8_1, NetAT8_3, NetAT9_1, NetAT9_3, NetAT11_1, NetAT11_3, NetAT13_1, NetAT13_3, NetAT15_1, NetAT15_3, NetAT53_1, NetAT53_3, NetAT54_1, NetAT54_3, NetAT55_1, NetAT55_3, NetC25_2, NetC114_2, NetC201_2, NetC829_2, NetC851_2, NetC869_2
net class 25 mil clearance: NetAT57_1, NetAT57_3, NetAT59_1, NetAT59_3, NetAT61_1, NetAT62_3, NetC18_2, NetC20_1, NetC111_2, NetC113_1, NetC188_2, NetC200_1, NetC401_1, NetC401_2, NetC402_1, NetC402_2, NetC722_1, NetC822_2, NetC828_1, NetC845_2, NetC850_1, NetC866_2, NetC868_1, NetC880_1, NetC881_2, NetC885_1, NetC956_2, NetC957_1, NetC958_2, NetC968_1, NetC968_2, NetC1228_1, NetC1229_2, STALO_p2-p3
net class 9.7 mil gap: NetC18_1, NetC20_2, NetC25_1, NetC29_2, NetC111_1, NetC113_2, NetC114_1, NetC188_1, NetC200_2, NetC201_1, NetC203_2, NetC822_1, NetC828_2, NetC829_1, NetC831_2, NetC845_1, NetC850_2, NetC851_1, NetC853_2, NetC866_1, NetC868_2, NetC869_1, NetC871_2

## Notes on the sheet
- AND DESIGN RIGHTS BELONGING TO GIGA-TRONICS
- THIS DOCUMENT CONTAINS PROPRIETARY INFORMATION
- EXCEPT CALIBRATION, OPERATION, AND MAINTENANCE
- AND MAY NOT BE REPRODUCED FOR ANY REASON
- STALO PAGE 2
- WITHOUT WRITTEN AUTHORIZATION.
- 68mA
- 217 mW
- (near R781) 217 mW
- IL = 19 dB
- IL = 1.5 dB
- IL = 3.5 dB
- -4.1 dBm nominal
- BANK 5
- BANK 3
- -0.1  to +0.9 dBm
- 85mA
- 36mA
- Extra attenuation here.
- ??
- BANK 1
- +14.3dBm
- .4mA max
- 0.25mA
- (near AT59) G = 21.5 dB @ 2.72 GHz, 20.5 dB @ 3.9 GHz
- (near U31) -1.5 to -2 dBm
- (near U33) +13.5 to +14.5 dBm
- +4.04 V
- (near FL48) IL = 0.7 dB
- -21 to -19 dBm
- -2 to -0 dBm
- (near U17) IL = 2.4 dB
- IL = 2.4 dB
- (near FL39) IL = 0.5 dB
- BANK 2
- (near U20) IL = 1.5 dB
- 250mA
- BANK 4
- BANK 6
- 1.     CAPACITORS VALUES ARE IN pF
- NOTES:
- 2.     RESISTOR  VALUES ARE IN OHMS
- UNLESS OTHERWISE SPECIFIED
- Title
- Sheet Title
- PRINTED DOCUMENT IS CONSIDERED UNCONTROLLED. VERIFY REVISION IN PLM SYSTEM.
- THIS DOCUMENT CONTAINS PROPRIETARY INFORMATION. DESIGN RIGHTS BELONG TO GIGA-TRONICS AND MAY NOT BE REPRODUCED WITHOUT WRITTEN AUTHORIZATION FOR ANY REASON EXCEPT CALIBRATION, OPERATION AND MAINTENANCE.
- Size
- CAGE CODE
- Filename
- D
- Document Number
- 58900
- Date
- Sheet
- Rev
- of
- (in symbol LFS0-00222) ,
- (in symbol LFS0-00250) ,
- (in symbol MMDC-00204) GND
- (in symbol MRSS-12012) GND